# EasyEDA Pro project ProPrj_keero_bot_2026-04-02.epro

# Schematic Schematic

## Sheets
1 Power_Sheet: Board Name: Mainboard; Create Date: 2026-04-02; Page Name: Power_Sheet; Project Name: keero_bot; Schematic Name: Schematic; Update Date: 2026-04-02; Add into BOM: yes; Company: Jakša Tomović; Convert to PCB: yes; Date: 2026-03-09; Draw By: Jakša Tomović; REV: 1.0; Sheet: 1/1; spicePre: .
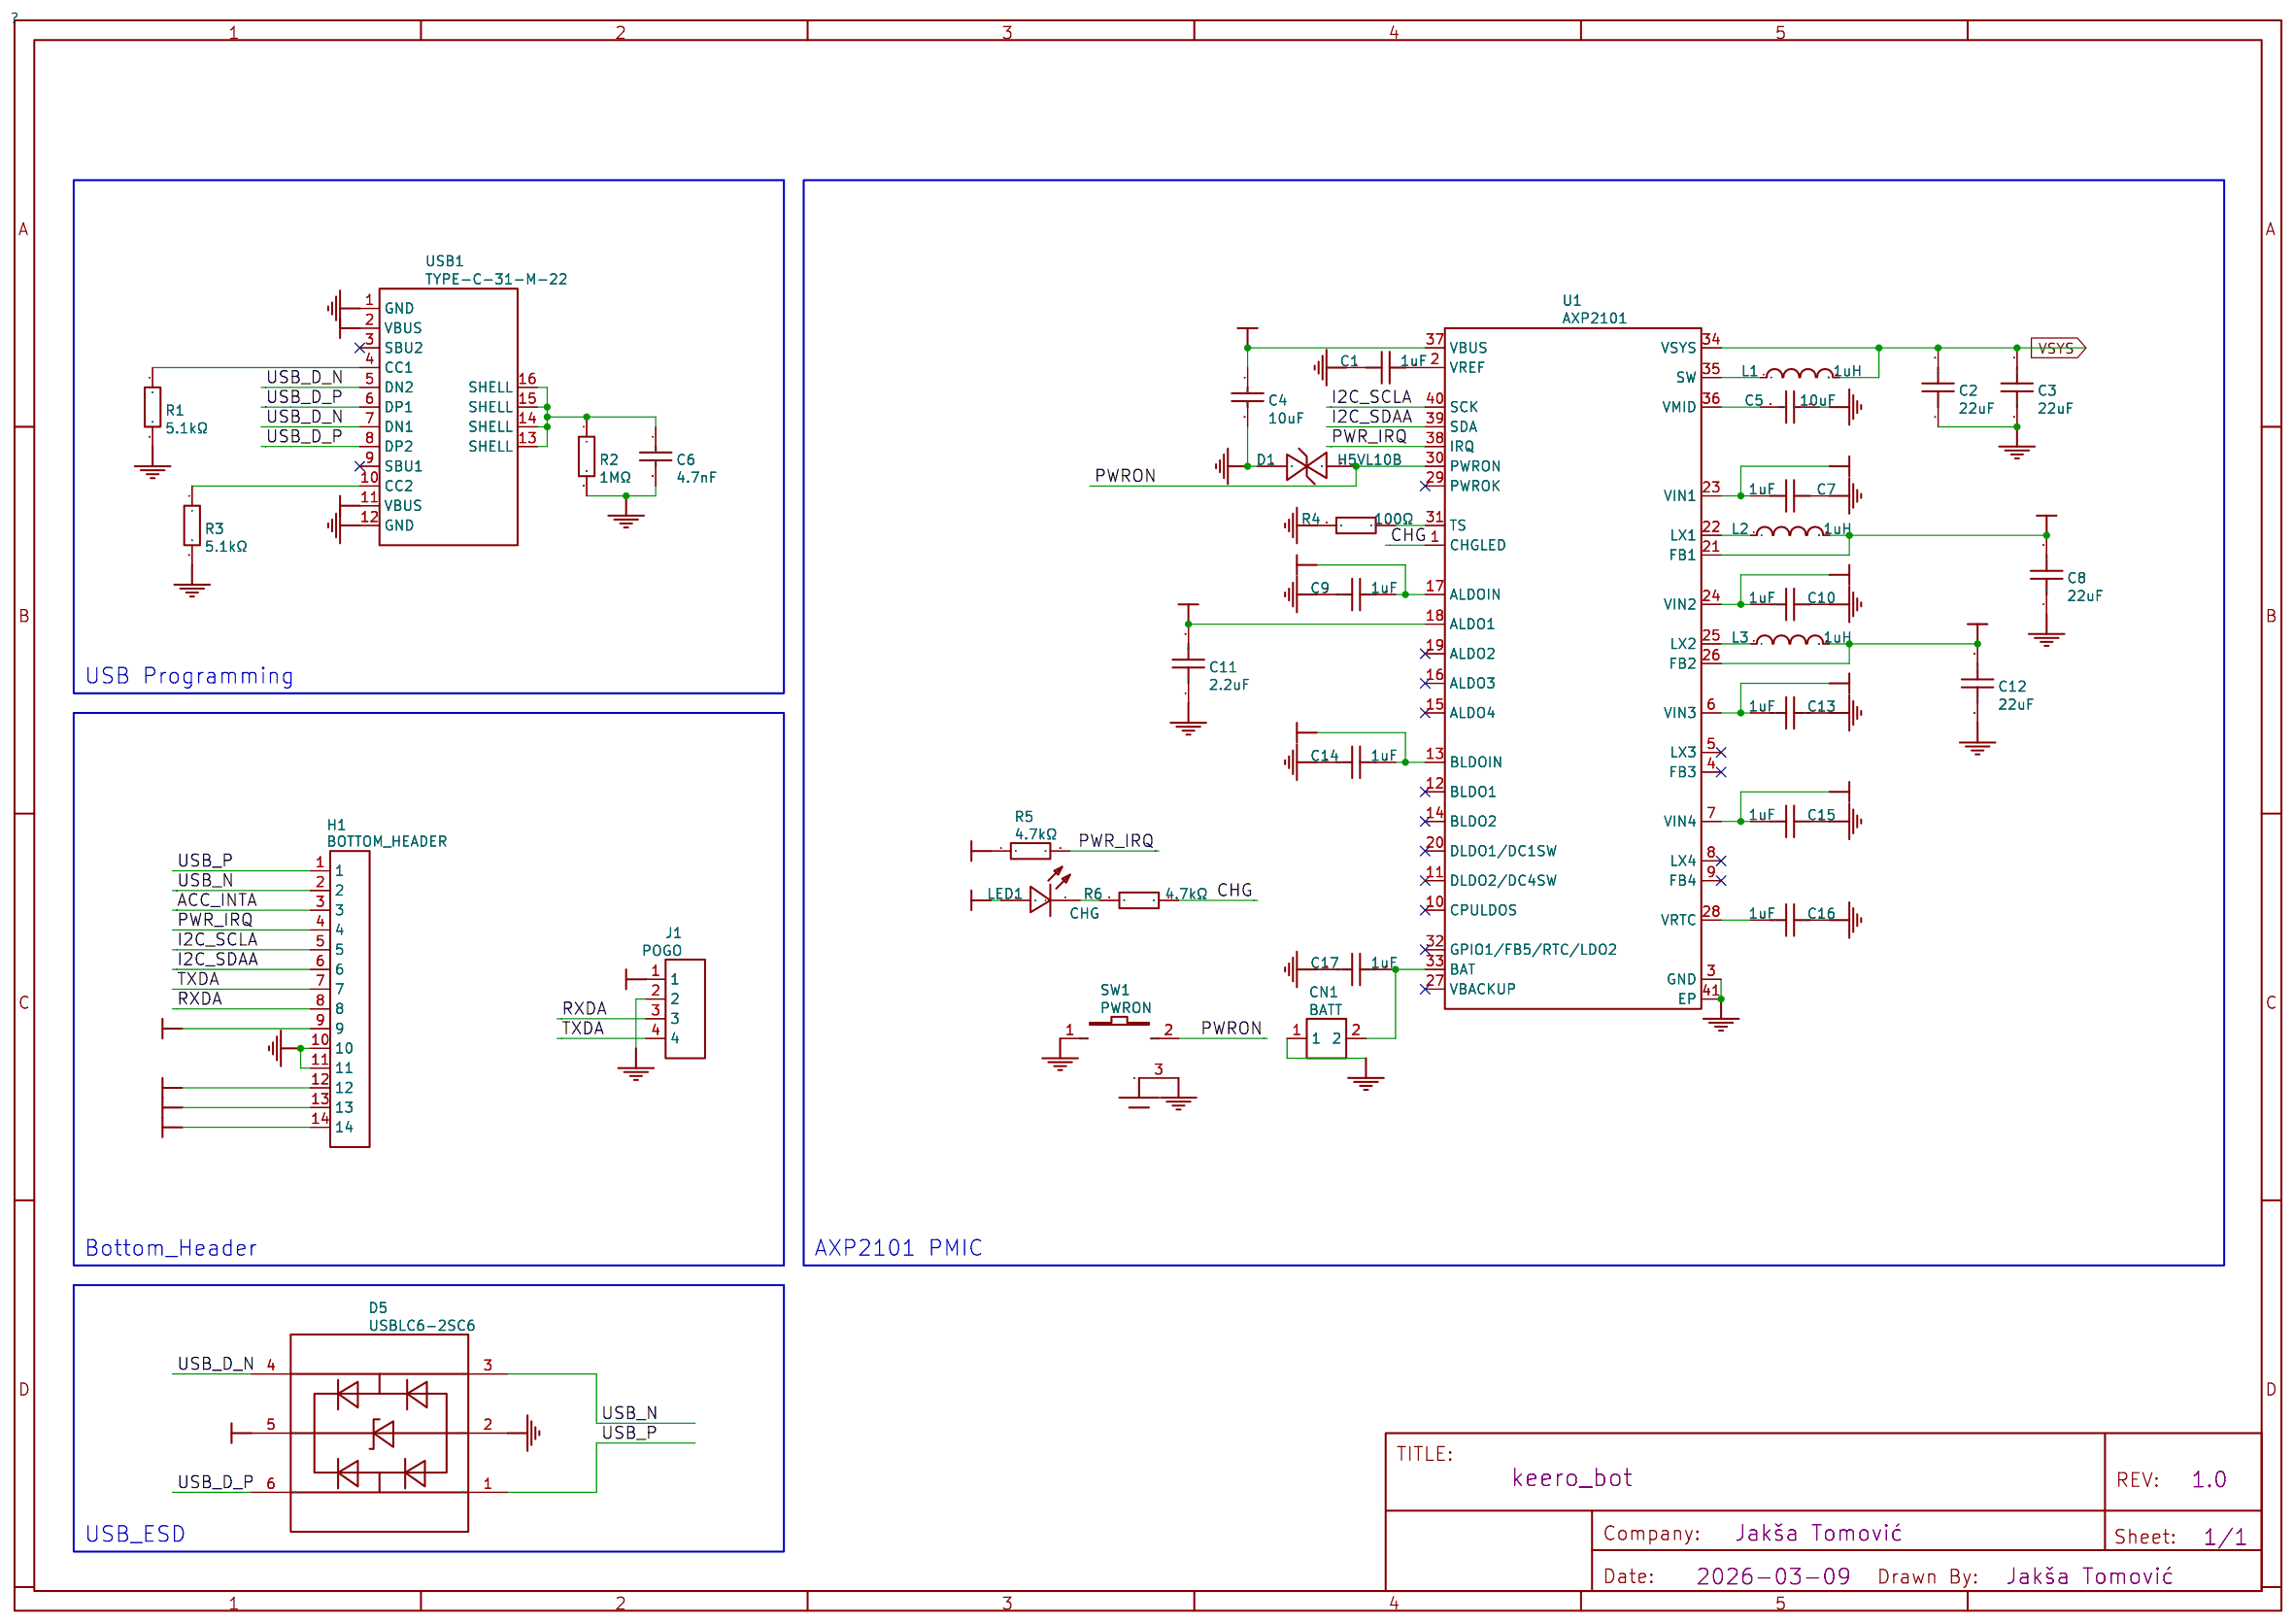
[diagram p0: Power_Sheet]
2 MCU_Sheet: Page Name: MCU_Sheet; Date: 2026-03-04
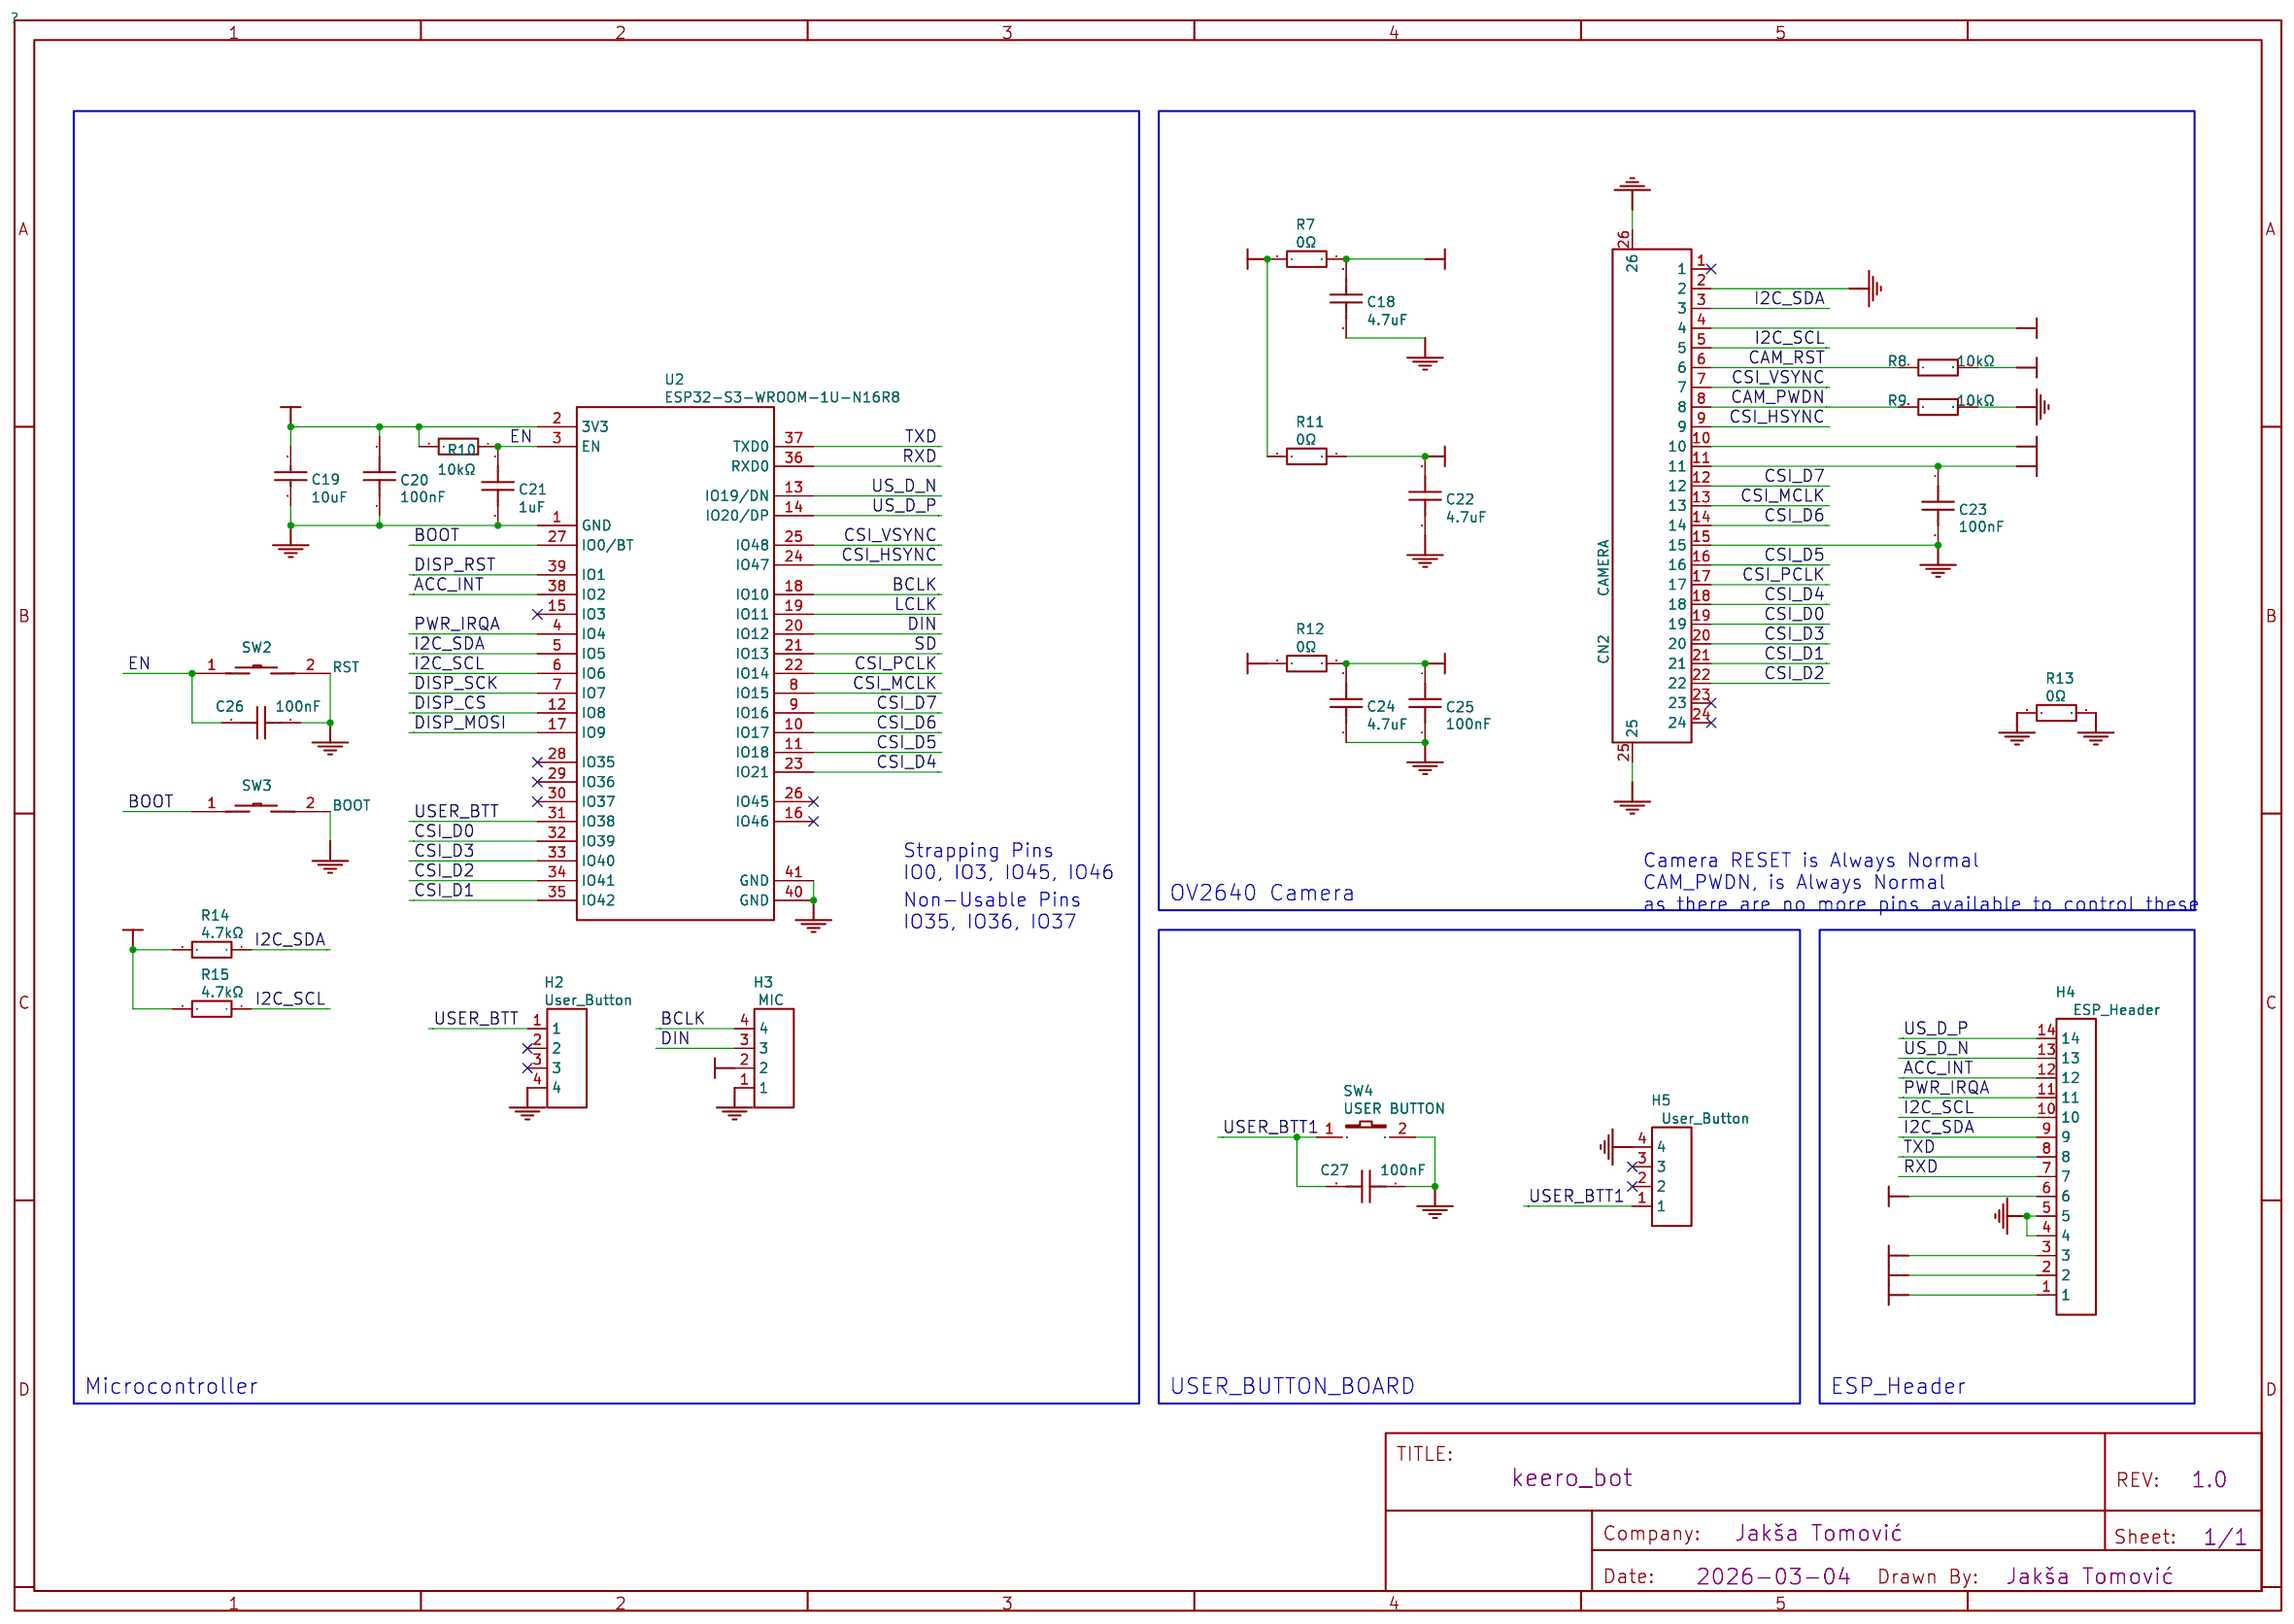
[diagram p1: MCU_Sheet]
3 Sensor_Sheet: Page Name: Sensor_Sheet; Date: 2026-03-08
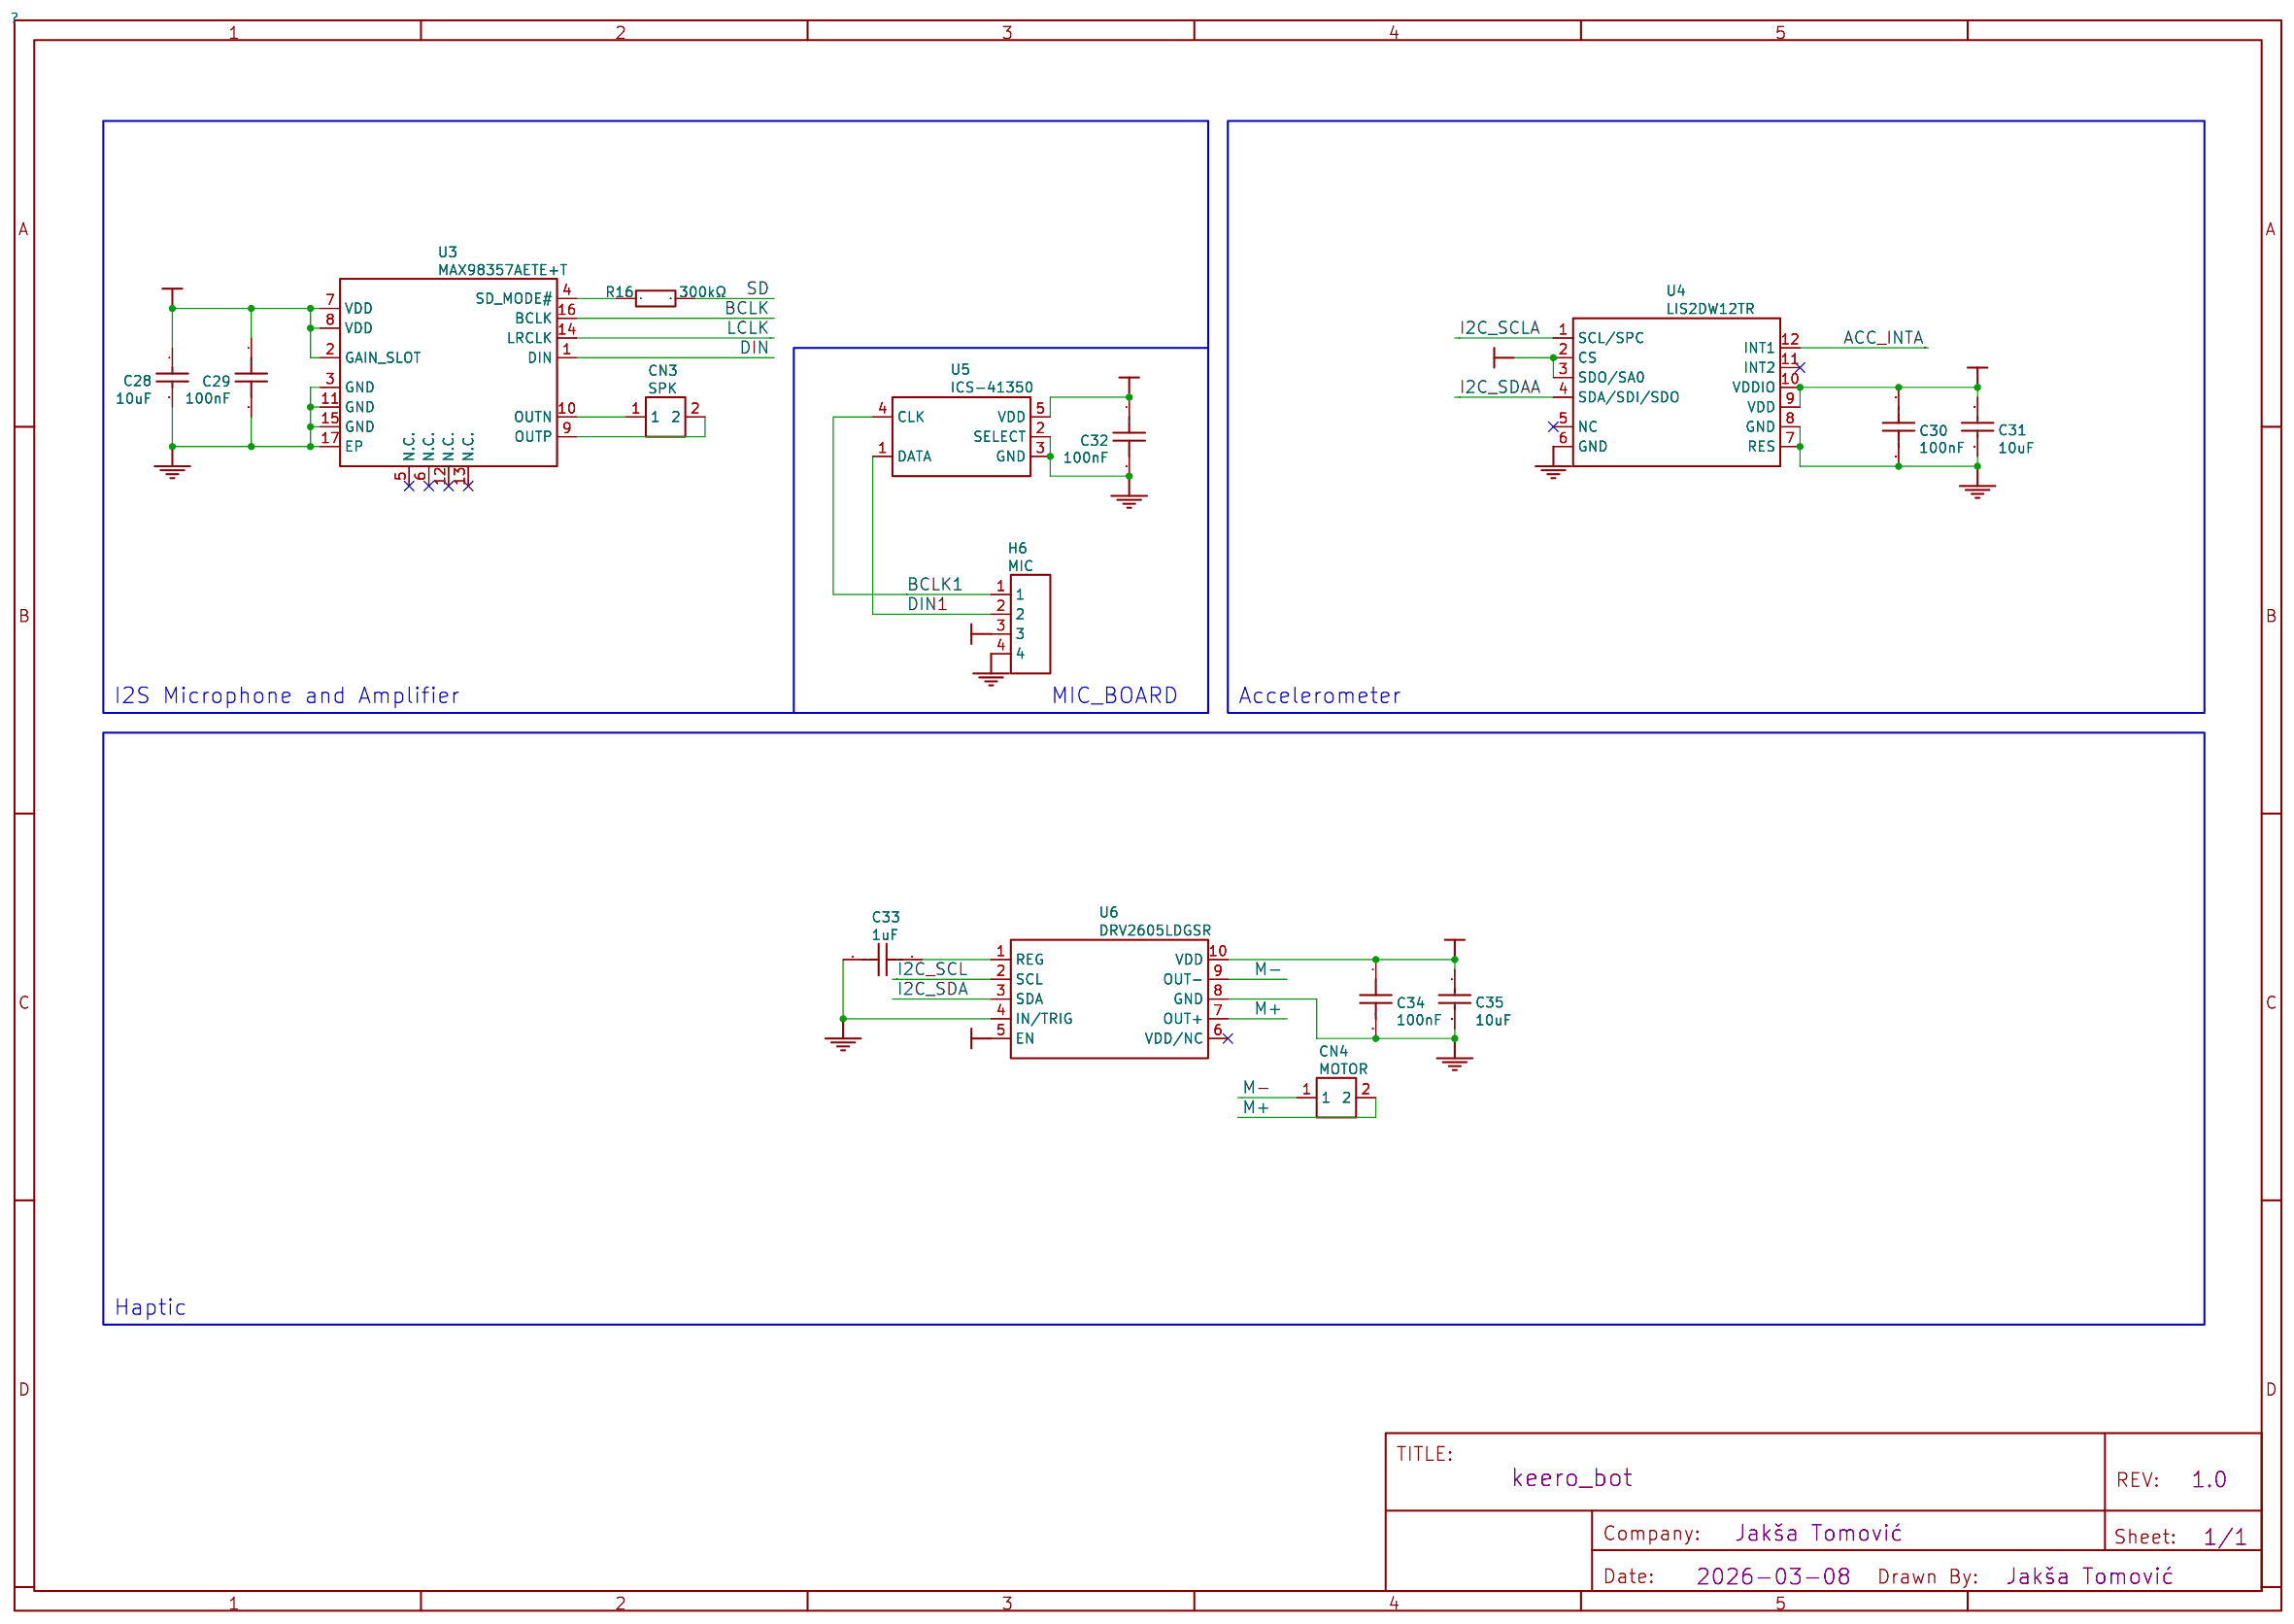
[diagram p2: Sensor_Sheet]
4 OLED_Sheet: Page Name: OLED_Sheet; Date: 2026-03-27
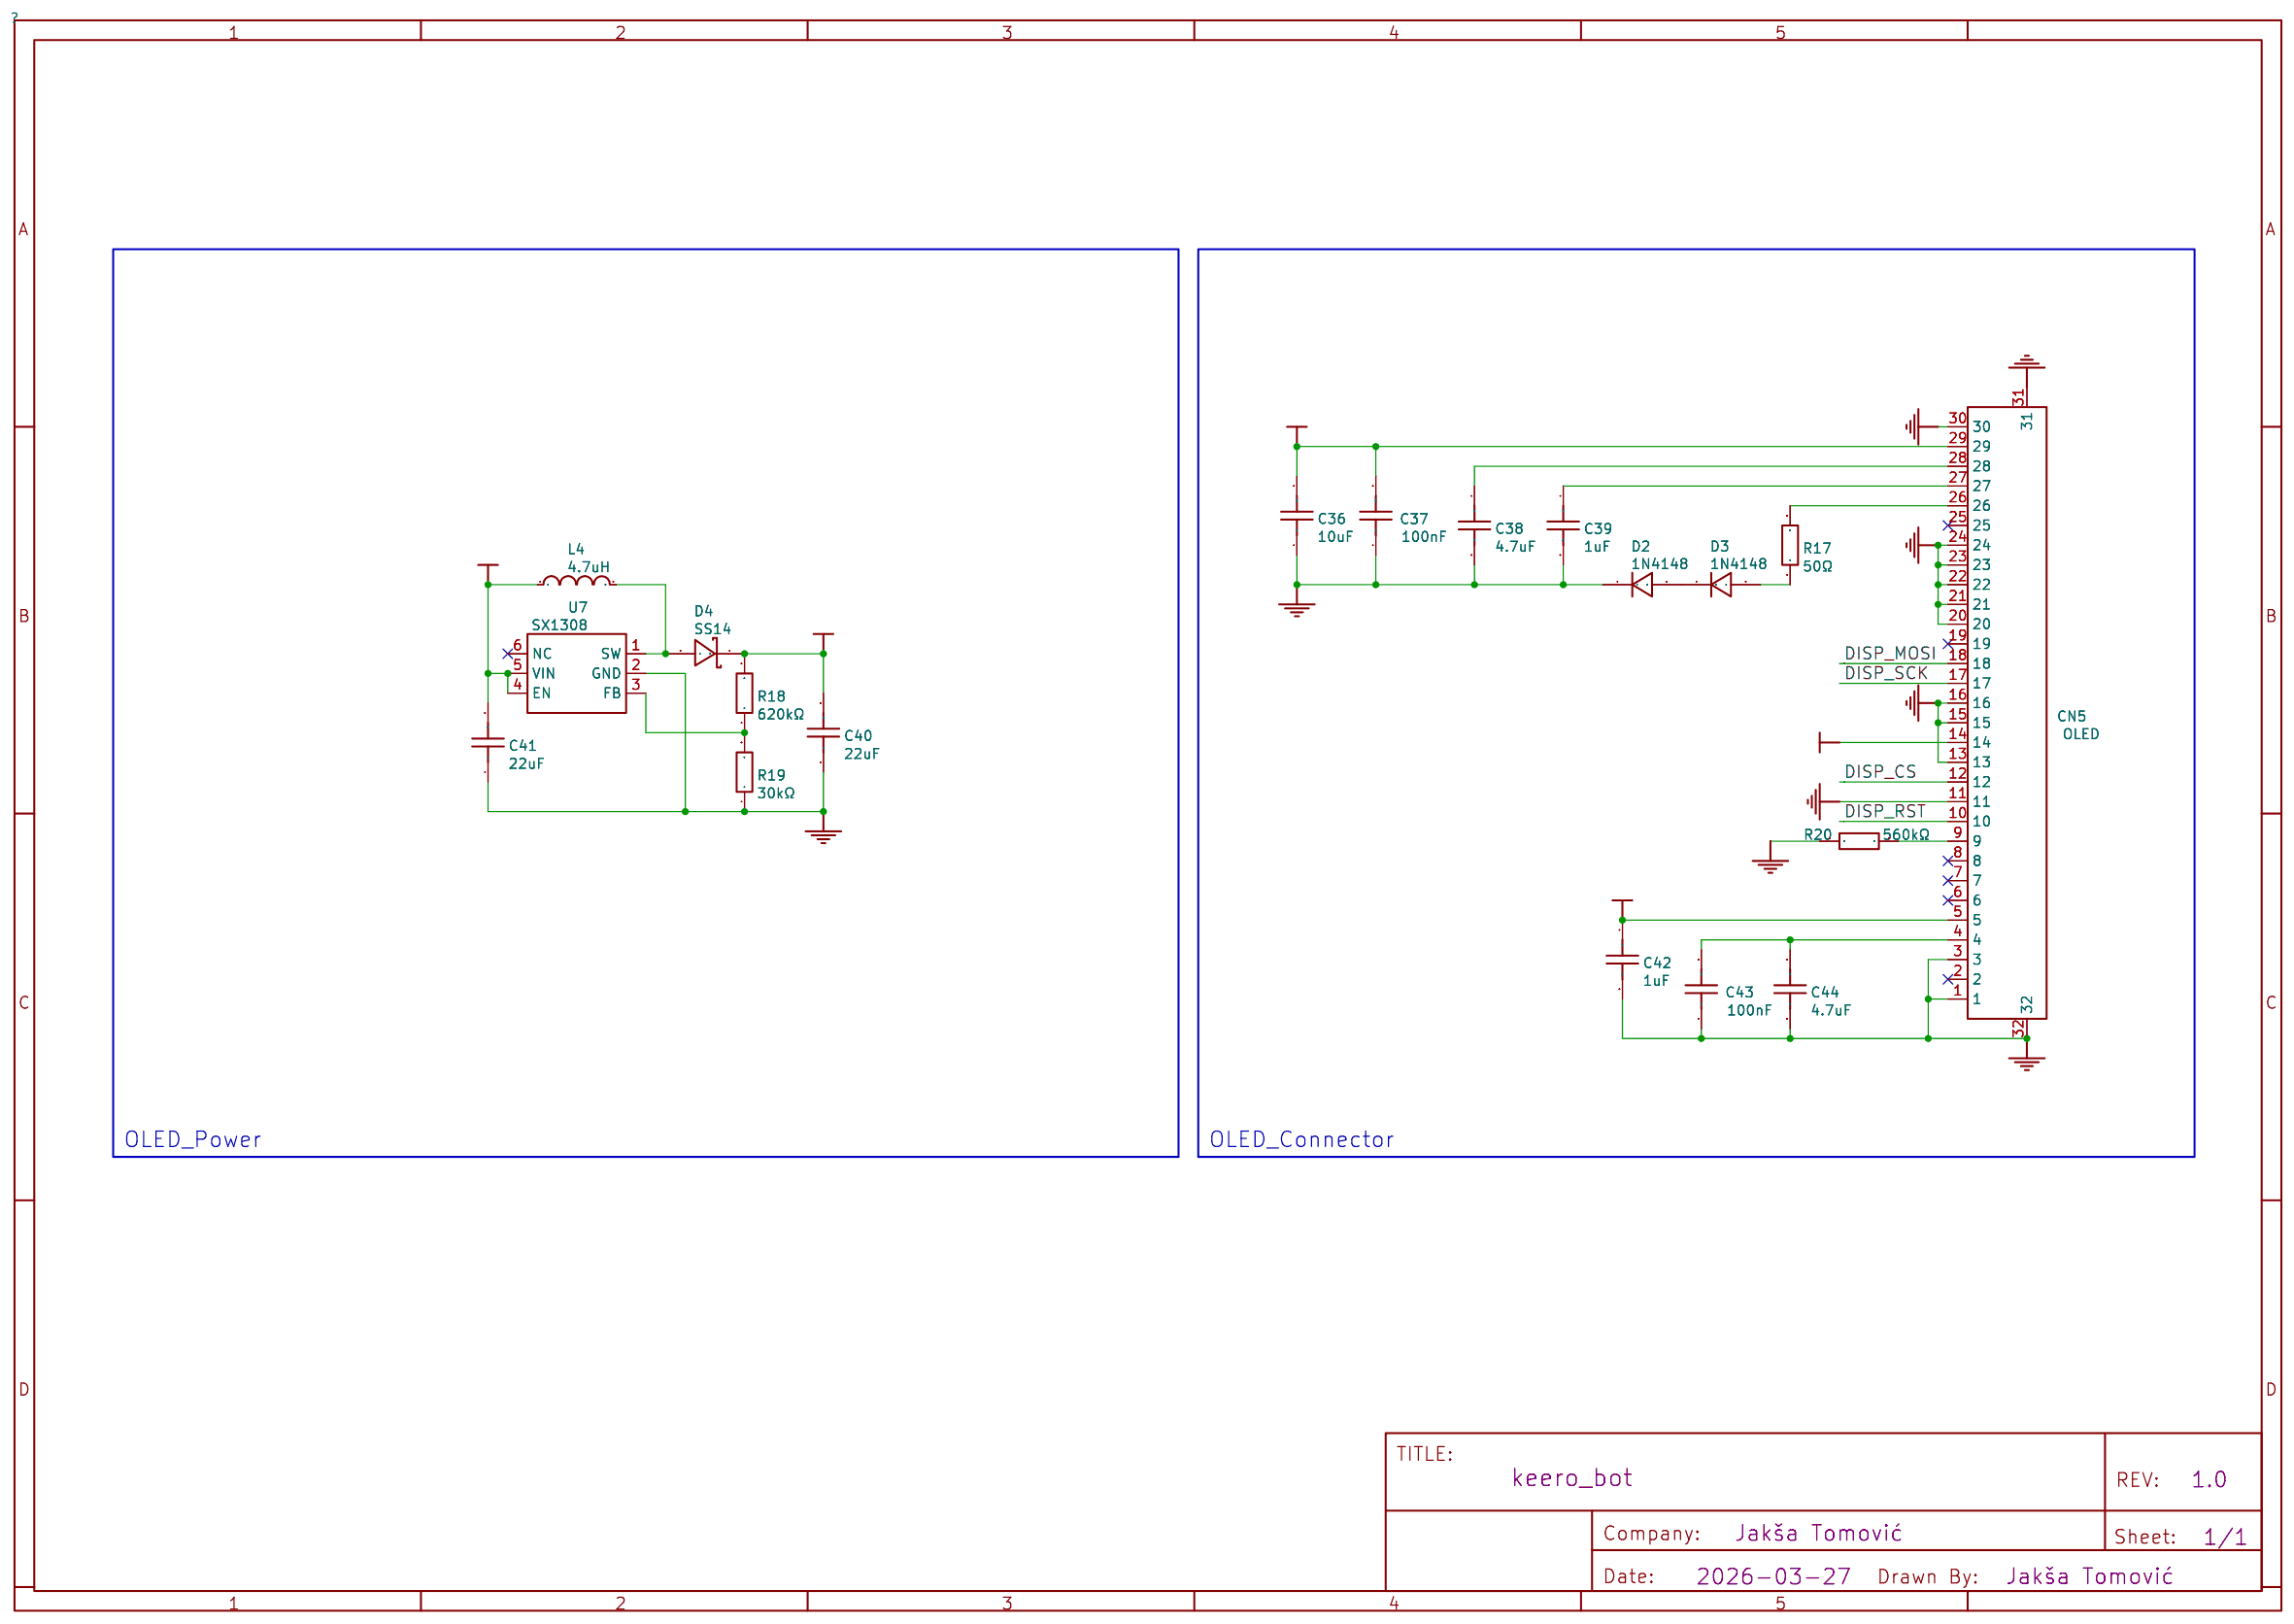
[diagram p3: OLED_Sheet]

## Parts
sheet MCU_Sheet
C18  4.7uF  [C0402_NEW]
C19  10uF  [C0402]
C20  100nF  [C0402]
C21  1uF  [C0402]
C22  4.7uF  [C0402_NEW]
C23  100nF  [C0402]
C24  4.7uF  [C0402_NEW]
C25  100nF  [C0402]
C26  100nF  [C0402]
C27  100nF  [C0402]
CN2  CAMERA  [FPC-SMD_KH-FG0.5-H2.0-24PIN]
H2  User_Button  [HDR-TH_4P-P1.27-V-M]
H3  MIC  [HDR-TH_4P-P1.27-V-M]
H4  ESP_Header  [HDR-TH_14P-P1.27-V-M]
H5  User_Button  [HDR-TH_4P-P1.27-H-F-W4.5-N]
R7  0Ω  [R0402]
R8  10kΩ  [R0402]
R9  10kΩ  [R0402]
R10  10kΩ  [R0402]
R11  0Ω  [R0402]
R12  0Ω  [R0402]
R13  0Ω  [R0402]
R14  4.7kΩ  [R0402]
R15  4.7kΩ  [R0402]
SW2  RST  [KEY-SMD_B3U-1000PM]
SW3  BOOT  [KEY-SMD_B3U-1000PM]
SW4  USER BUTTON  [KEY-SMD_2P-L6.2-W3.6-LS8.0]
U2  ESP32-S3-WROOM-1U-N16R8  [WIRELM-SMD_ESP32-S3-WROOM-1U]
sheet OLED_Sheet
C36  10uF  [C0603]
C37  100nF  [C0402]
C38  4.7uF  [C0402_NEW]
C39  1uF  [C0402]
C40  22uF  [C0805]
C41  22uF  [C0805]
C42  1uF  [C0402]
C43  100nF  [C0402]
C44  4.7uF  [C0402_NEW]
CN5  OLED  [FPC-SMD_KH-FG0.5-H2.0-30PIN]
D2  1N4148  [SOD-323_L1.8-W1.3-LS2.5-RD]
D3  1N4148  [SOD-323_L1.8-W1.3-LS2.5-RD]
D4  SS14  [SMA_L4.2-W2.6-LS5.0-RD_1]
L4  4.7uH  [IND-SMD_L4.4-W4.2]
R17  50Ω  [R0402]
R18  620kΩ  [R0402]
R19  30kΩ  [R0402]
R20  560kΩ  [R0402]
U7  SX1308  [SOT-23-6_L2.9-W1.6-P0.95-LS2.8-BL]
sheet Power_Sheet
C1  1uF  [C0402]
C2  22uF  [C0402_NEW]
C3  22uF  [C0402_NEW]
C4  10uF  [C0402]
C5  10uF  [C0402]
C6  4.7nF  [C0402]
C7  1uF  [C0402]
C8  22uF  [C0402_NEW]
C9  1uF  [C0402]
C10  1uF  [C0402]
C11  2.2uF  [C0402]
C12  22uF  [C0402_NEW]
C13  1uF  [C0402]
C14  1uF  [C0402]
C15  1uF  [C0402]
C16  1uF  [C0402]
C17  1uF  [C0402]
CN1  BATT  [CONN-TH_1.25T-2AW]
D1  H5VL10B  [SOD-882_L1.0-W0.6-BI]
D5  USBLC6-2SC6  [SOT-23-6_L2.9-W1.6-P0.95-LS2.8-BL]
H1  BOTTOM_HEADER  [HDR-TH_14P-P1.27-H-F-W4.5-N]
J1  POGO  [POGO CONTACT 2]
L1  1uH  [L0805]
L2  1uH  [L0805]
L3  1uH  [L0805]
LED1  CHG  [LED0603-RD]
R1  5.1kΩ  [R0402]
R2  1MΩ  [R0402]
R3  5.1kΩ  [R0402]
R4  100Ω  [R0402]
R5  4.7kΩ  [R0402]
R6  4.7kΩ  [R0402]
SW1  PWRON  [KEY-TH_K2-1109DE-CXXW-XX]
U1  AXP2101  [QFN-40_L5.0-W5.0-P0.40-TL-EP3.4]
USB1  TYPE-C-31-M-22  [USB-C-SMD_TYPE-C-31-M-22]
sheet Sensor_Sheet
C28  10uF  [C0402]
C29  100nF  [C0402]
C30  100nF  [C0402]
C31  10uF  [C0402]
C32  100nF  [C0402]
C33  1uF  [C0402]
C34  100nF  [C0402]
C35  10uF  [C0402]
CN3  SPK  [CONN-TH_1.25T-2AW]
CN4  MOTOR  [CONN-TH_1.25T-2AW]
H6  MIC  [HDR-TH_4P-P1.27-H-F-W4.5-N]
R16  300kΩ  [R0402]
U3  MAX98357AETE+T  [TQFN-16_L3.0-W3.0-P0.50-BL-EP1.5]
U4  LIS2DW12TR  [LGA-12_L2.0-W2.0-P0.50-BL]
U5  ICS-41350  [MIC-SMD_5P-L3.5-W2.7-TL]
U6  DRV2605LDGSR  [VSSOP-10_L3.0-W3.0-P0.50-LS4.9-BL]

## Library data of the parts
C18 C22 C24 = 4.7uF: Supplier: LCSC; Manufacturer Part: CL05A475MP5NRNC; Manufacturer: SAMSUNG(三星); Supplier Part: C23733; JLCPCB Part Class: Basic Part; nameAlias: Value; spicePre: C; spiceSymbolName: CL05A475MP5NRNC
C4 C5 C19 C28 C31 C35 = 10uF: Supplier: LCSC; Manufacturer Part: CL05A106MQ5NUNC; Manufacturer: SAMSUNG(三星); Supplier Part: C15525; JLCPCB Part Class: Basic Part; nameAlias: Value; spicePre: C; spiceSymbolName: CL05A106MQ5NUNC
C20 C23 C25-C27 C29 C30 C32 C34 C37 C43 = 100nF: Supplier: LCSC; Supplier Part: C307331; Manufacturer: SAMSUNG(三星); Manufacturer Part: CL05B104KB54PNC; JLCPCB Part Class: Basic Part; nameAlias: Value; Contributor: LCSC; spicePre: C; spiceSymbolName: CL05B104KB54PNC
C1 C7 C9 C10 C13-C17 C21 C33 C39 C42 = 1uF: Supplier: LCSC; Manufacturer: SAMSUNG(三星); Manufacturer Part: CL05A105KA5NQNC; Supplier Part: C52923; JLCPCB Part Class: Basic Part; nameAlias: Value; spicePre: C; spiceSymbolName: CL05A105KA5NQNC
CN2 = CAMERA: JLCPCB Part Class: Extended Part; Supplier: LCSC; Supplier Part: C2797213; Manufacturer: kinghelm(金航标); Manufacturer Part: KH-FG0.5-H2.0-24PIN; Contributor: LCSC; spicePre: C; spiceSymbolName: KH-FG0.5-H2.0-24PIN
H2 = User_Button: Supplier: LCSC; Supplier Part: C2881649; Manufacturer: XKB Connection(中国星坤); Manufacturer Part: X1311WV-04J-C18D27; JLCPCB Part Class: Extended Part; Contributor: LCSC; spicePre: U; spiceSymbolName: X1311WV-04J-C18D27
H3 = MIC: Supplier: LCSC; Supplier Part: C2881649; Manufacturer: XKB Connection(中国星坤); Manufacturer Part: X1311WV-04J-C18D27; JLCPCB Part Class: Extended Part; Contributor: LCSC; spicePre: U; spiceSymbolName: X1311WV-04J-C18D27
H4 = ESP_Header: Supplier: LCSC; Supplier Part: C2881659; Manufacturer: XKB Connection(中国星坤); Manufacturer Part: X1311WV-14J-C18D27; JLCPCB Part Class: Extended Part; Contributor: LCSC; spicePre: U; spiceSymbolName: X1311WV-14J-C18D27
H5 = User_Button: Supplier: LCSC; Supplier Part: C2881475; Manufacturer: XKB Connection(中国星坤); Manufacturer Part: X1311FR-04-C43D24; JLCPCB Part Class: Extended Part; Contributor: LCSC; spicePre: U; spiceSymbolName: X1311FR-04-C43D24
R7 R11-R13 = 0Ω: Supplier: LCSC; Manufacturer: UNI-ROYAL(厚声); Manufacturer Part: 0402WGF0000TCE; Supplier Part: C17168; JLCPCB Part Class: Basic Part; nameAlias: Value; spicePre: R; spiceSymbolName: 0402WGF0000TCE
R8-R10 = 10kΩ: Supplier: LCSC; Manufacturer: UNI-ROYAL(厚声); Manufacturer Part: 0402WGF1002TCE; Supplier Part: C25744; JLCPCB Part Class: Basic Part; nameAlias: Value; spicePre: R; spiceSymbolName: 0402WGF1002TCE
R5 R6 R14 R15 = 4.7kΩ: Supplier: LCSC; Manufacturer: UNI-ROYAL(厚声); Manufacturer Part: 0402WGF4701TCE; Supplier Part: C25900; JLCPCB Part Class: Basic Part; nameAlias: Value; spicePre: R; spiceSymbolName: 0402WGF4701TCE
SW2 = RST: Supplier: LCSC; Supplier Part: C231329; Manufacturer: OMRON(欧姆龙); Manufacturer Part: B3U-1000P; JLCPCB Part Class: Extended Part; Contributor: LCSC; spicePre: S; spiceSymbolName: B3U-1000P
SW3 = BOOT: Supplier: LCSC; Supplier Part: C231329; Manufacturer: OMRON(欧姆龙); Manufacturer Part: B3U-1000P; JLCPCB Part Class: Extended Part; Contributor: LCSC; spicePre: S; spiceSymbolName: B3U-1000P
SW4 = USER BUTTON: Supplier Part: C118141; Supplier: LCSC; Manufacturer Part: K2-1107ST-A4SW-06; 制造商: 韩国韩荣; Contributor: LCEDA_Lib; spicePre: K; spiceSymbolName: K2-3.6×6.1_SMD
U2 = ESP32-S3-WROOM-1U-N16R8: Supplier: LCSC; Supplier Part: C3013946; Manufacturer: ESPRESSIF(乐鑫); JLCPCB Part Class: Extended Part; Contributor: shaikhabdulmobeen; spicePre: U
C36 = 10uF: Supplier: LCSC; Manufacturer: SAMSUNG(三星); Manufacturer Part: CL10A106MA8NRNC; Supplier Part: C96446; JLCPCB Part Class: Basic Part; nameAlias: Value; spicePre: C; spiceSymbolName: CL10A106MA8NRNC
C38 C44 = 4.7uF: Supplier: LCSC; Supplier Part: C318563; Manufacturer: SAMSUNG(三星); Manufacturer Part: CL05A475MO5NUNC; JLCPCB Part Class: Extended Part; nameAlias: Value; Contributor: LCSC; spicePre: C; spiceSymbolName: CL05A475MO5NUNC
C40 C41 = 22uF: Supplier: LCSC; Manufacturer: SAMSUNG(三星); Manufacturer Part: CL21A226MAQNNNE; Supplier Part: C45783; JLCPCB Part Class: Basic Part; nameAlias: Value; spicePre: C; spiceSymbolName: CL21A226MAQNNNE
CN5 = OLED: JLCPCB Part Class: Extended Part; Supplier: LCSC; Supplier Part: C2797216; Manufacturer: kinghelm(金航标); Manufacturer Part: KH-FG0.5-H2.0-30PIN; Contributor: LCSC; spicePre: C; spiceSymbolName: KH-FG0.5-H2.0-30PIN
D2 D3 = 1N4148: Supplier: LCSC; Manufacturer: CJ(江苏长电/长晶); Manufacturer Part: 1N4148WS; Supplier Part: C2128; JLCPCB Part Class: Basic Part; spicePre: D; spiceSymbolName: 1N4148WS T4
D4 = SS14: Supplier: LCSC; Manufacturer: MDD(辰达半导体); Supplier Part: C2480; JLCPCB Part Class: Basic Part; spicePre: D
L4 = 4.7uH: Supplier: LCSC; Manufacturer: cjiang(长江微电); Manufacturer Part: FXL0420-4R7-M; Supplier Part: C167208; JLCPCB Part Class: Extended Part; nameAlias: Value; Contributor: LCSC; spicePre: L; spiceSymbolName: FXL0420-4R7-M
R17 = 50Ω: Supplier: LCSC; Supplier Part: C853312; Manufacturer: YAGEO(国巨); Manufacturer Part: RT0402BRE0750RL; JLCPCB Part Class: Extended Part; Contributor: lcsc; nameAlias: Value; spicePre: U; spiceSymbolName: RT0402BRE0750RL
R18 = 620kΩ: Supplier: LCSC; Manufacturer: UNI-ROYAL(厚声); Manufacturer Part: 0402WGJ0624TCE; Supplier Part: C11860; JLCPCB Part Class: Extended Part; nameAlias: Value; spicePre: R; spiceSymbolName: 0402WGJ0624TCE
R19 = 30kΩ: Supplier: LCSC; Manufacturer: UNI-ROYAL(厚声); Manufacturer Part: 0402WGJ0303TCE; Supplier Part: C25553; JLCPCB Part Class: Extended Part; nameAlias: Value; spicePre: R; spiceSymbolName: 0402WGJ0303TCE
R20 = 560kΩ: Supplier: LCSC; Manufacturer: UNI-ROYAL(厚声); Manufacturer Part: 0402WGJ0564TCE; Supplier Part: C25566; JLCPCB Part Class: Extended Part; nameAlias: Value; spicePre: R; spiceSymbolName: 0402WGJ0564TCE
U7 = SX1308: Supplier: LCSC; Manufacturer: SX(硕芯科技); Supplier Part: C78162; JLCPCB Part Class: Extended Part; sourceId: g4Yg9rJ1j; timeStamp: 1472247539; spicePre: U
C2 C3 C8 C12 = 22uF: Supplier: LCSC; Supplier Part: C105226; Manufacturer: SAMSUNG(三星); Manufacturer Part: CL05A226MQ5QUNC; JLCPCB Part Class: Extended Part; nameAlias: Value; Contributor: lcsc; spicePre: C; spiceSymbolName: CL05A226MQ5QUNC
C6 = 4.7nF: Supplier: LCSC; Manufacturer: FH(风华); Manufacturer Part: 0402B472K500NT; Supplier Part: C1538; JLCPCB Part Class: Basic Part; nameAlias: Value; spicePre: C; spiceSymbolName: 0402B472K500NT
C11 = 2.2uF: Supplier: LCSC; Manufacturer: SAMSUNG(三星); Manufacturer Part: CL05A225MQ5NSNC; Supplier Part: C12530; JLCPCB Part Class: Basic Part; nameAlias: Value; spicePre: C; spiceSymbolName: CL05A105KA5NQNC
CN1 = BATT: Supplier: LCSC; Supplier Part: C722634; Manufacturer: CAX(创都); Manufacturer Part: 1.25T-2AW; JLCPCB Part Class: Extended Part; Contributor: LCSC; spicePre: C; spiceSymbolName: 1.25T-2AW_C722634
D1 = H5VL10B: Supplier: LCSC; Supplier Part: C7420372; Manufacturer: R+O(宏嘉诚); JLCPCB Part Class: Extended Part; Contributor: lcsc; spicePre: D
D5 = USBLC6-2SC6: Supplier: LCSC; Manufacturer: ST(意法半导体); Supplier Part: C7519; JLCPCB Part Class: Extended Part; spicePre: D
H1 = BOTTOM_HEADER: Supplier: LCSC; Supplier Part: C2881485; Manufacturer: XKB Connection(中国星坤); Manufacturer Part: X1311FR-14-C43D24; JLCPCB Part Class: Extended Part; Contributor: LCSC; spicePre: U; spiceSymbolName: X1311FR-14-C43D24
J1 = POGO: Contributor: shaikhabdulmobeen; spicePre: J; spiceSymbolName: POGO CUSTOM
L1-L3 = 1uH: Supplier: LCSC; Manufacturer: Sunlord(顺络); Manufacturer Part: MPL2012S1R0MHT; Supplier Part: C98332; JLCPCB Part Class: Extended Part; nameAlias: Value; spicePre: L; spiceSymbolName: MPL2012S1R0MHT
LED1 = CHG: Supplier: LCSC; Manufacturer: KENTO; Manufacturer Part: KT-0603R; Supplier Part: C2286; JLCPCB Part Class: Basic Part; spicePre: L; spiceSymbolName: KT-0603R
R1 R3 = 5.1kΩ: Supplier: LCSC; Manufacturer: UNI-ROYAL(厚声); Manufacturer Part: 0402WGF5101TCE; Supplier Part: C25905; JLCPCB Part Class: Basic Part; nameAlias: Value; spicePre: R; spiceSymbolName: 0402WGF5101TCE
R2 = 1MΩ: Supplier: LCSC; Manufacturer: UNI-ROYAL(厚声); Manufacturer Part: 0402WGF1004TCE; Supplier Part: C26083; JLCPCB Part Class: Basic Part; nameAlias: Value; spicePre: R; spiceSymbolName: 0402WGF1004TCE
R4 = 100Ω: Supplier: LCSC; Manufacturer: UNI-ROYAL(厚声); Manufacturer Part: 0402WGF1000TCE; Supplier Part: C25076; JLCPCB Part Class: Basic Part; nameAlias: Value; spicePre: R; spiceSymbolName: 0402WGF1000TCE
SW1 = PWRON: Supplier: LCSC; Supplier Part: C223805; Manufacturer: 韩国韩荣; Manufacturer Part: K2-1109DE-A4SW-01; JLCPCB Part Class: Extended Part; Contributor: LCSC; spicePre: S; spiceSymbolName: K2-1109DE-A4SW-01
U1 = AXP2101: Supplier: LCSC; Supplier Part: C3036461; Manufacturer: x-powers; JLCPCB Part Class: Extended Part; Contributor: shaikhabdulmobeen; spicePre: U
USB1 = TYPE-C-31-M-22: Supplier: LCSC; Supplier Part: C530612; Manufacturer: 韩国韩荣; JLCPCB Part Class: Extended Part; Contributor: LCSC; spicePre: U
CN3 = SPK: Supplier: LCSC; Supplier Part: C722634; Manufacturer: CAX(创都); Manufacturer Part: 1.25T-2AW; JLCPCB Part Class: Extended Part; Contributor: LCSC; spicePre: C; spiceSymbolName: 1.25T-2AW_C722634
CN4 = MOTOR: Supplier: LCSC; Supplier Part: C722634; Manufacturer: CAX(创都); Manufacturer Part: 1.25T-2AW; JLCPCB Part Class: Extended Part; Contributor: LCSC; spicePre: C; spiceSymbolName: 1.25T-2AW_C722634
H6 = MIC: Supplier: LCSC; Supplier Part: C2881475; Manufacturer: XKB Connection(中国星坤); Manufacturer Part: X1311FR-04-C43D24; JLCPCB Part Class: Extended Part; Contributor: LCSC; spicePre: U; spiceSymbolName: X1311FR-04-C43D24
R16 = 300kΩ: Supplier: LCSC; Manufacturer: UNI-ROYAL(厚声); Manufacturer Part: 0402WGF3003TCE; Supplier Part: C25774; JLCPCB Part Class: Extended Part; nameAlias: Value; spicePre: R; spiceSymbolName: 0402WGF3003TCE
U3 = MAX98357AETE+T: Supplier: LCSC; Supplier Part: C910544; Manufacturer: ADI(亚德诺)/MAXIM(美信); JLCPCB Part Class: Extended Part; Contributor: shaikhabdulmobeen; spicePre: U
U4 = LIS2DW12TR: Supplier: LCSC; Supplier Part: C189624; Manufacturer: ST(意法半导体); JLCPCB Part Class: Extended Part; Contributor: LCSC; spicePre: U
U5 = ICS-41350: Supplier: LCSC; Supplier Part: C3171856; Manufacturer: TDK InvenSense(应美盛); JLCPCB Part Class: Extended Part; Contributor: shaikhabdulmobeen; spicePre: U
U6 = DRV2605LDGSR: Supplier: LCSC; Supplier Part: C527464; Manufacturer: TI(德州仪器); JLCPCB Part Class: Extended Part; Contributor: LCSC; spicePre: U

## Nets
1V5: H4.3 R12.1
1V5A: C12.2 H1.12 L3.2 U1.26(FB2)
2V8: H4.2 R7.1 R11.1
2V8A: C11.2 H1.13 U1.18(ALDO1)
3V3: C19.1 C20.1 C28.1 C29.1 C34.1 C35.1 C42.1 CN5.5 CN5.14 H3.2 H4.6 R10.2 R14.2 R15.2 U2.2(3V3) U3.2(GAIN_SLOT) U3.7(VDD) U3.8(VDD) U6.5(EN) U6.10(VDD)
3V3A: C8.2 C30.1 C31.1 C41.2 H1.9 J1.1 L2.2 L4.1 R5.1 U1.21(FB1) U4.2(CS) U4.3(SDO/SA0) U4.9(VDD) U4.10(VDDIO) U7.4(EN) U7.5(VIN)
3V3B: C32.1 H6.3 U5.5(VDD)
AGND: C22.1 CN2.2 R13.2
GND: C1.1 C2.1 C3.1 C4.2 C5.2 C6.2 C7.1 C8.1 C9.1 C10.1 C11.1 C12.1 C13.1 C14.1 C15.1 C16.1 C17.1 C18.1 C19.2 C20.2 C21.2 C23.2 C24.1 C25.2 C26.1 C27.1 C28.2 C29.2 C30.2 C31.2 C32.2 C33.2 C34.2 C35.2 C36.1 C37.1 C38.2 C39.2 C40.1 C41.1 C42.2 C43.1 C44.2 CN1.1 CN2.15 CN2.25 CN2.26 CN5.1 CN5.3 CN5.11 CN5.13 CN5.15 CN5.16 CN5.20 CN5.21 CN5.22 CN5.23 CN5.24 CN5.30 CN5.31 CN5.32 D1.2(A) D2.1(K) D5.2 H1.10 H1.11 H2.4 H3.1 H4.4 H4.5 H5.4 H6.4 J1.2 R1.2 R2.2 R3.2 R4.1 R9.2 R13.1 R19.1 R20.1 SW1.1 SW1.3 SW2.2 SW3.2 SW4.2 U1.3(GND) U1.41(EP) U2.1(GND) U2.40(GND) U2.41(GND) U3.3(GND) U3.11(GND) U3.15(GND) U3.17(EP) U4.6(GND) U4.7(RES) U4.8(GND) U5.2(SELECT) U5.3(GND) U6.4(IN/TRIG) U6.8(GND) U7.2(GND) USB1.1(GND) USB1.12(GND)
VBUS: C4.1 D5.5 U1.37(VBUS) USB1.2(VBUS) USB1.11(VBUS)
ACC_INT: H4.12 U2.38(IO2)
ACC_INTA: H1.3 U4.12(INT1)
AV_2.8V: C22.2 CN2.4 R11.2
BCLK: H3.4 U2.18(IO10) U3.16(BCLK)
BCLK1: H6.1 U5.4(CLK)
BOOT: SW3.1 U2.27(IO0/BT)
CAM_PWDN: CN2.8 R9.1
CAM_RST: CN2.6 R8.1
CHG: R6.1 U1.1(CHGLED)
CSI_D0: CN2.19 U2.32(IO39)
CSI_D1: CN2.21 U2.35(IO42)
CSI_D2: CN2.22 U2.34(IO41)
CSI_D3: CN2.20 U2.33(IO40)
CSI_D4: CN2.18 U2.23(IO21)
CSI_D5: CN2.16 U2.11(IO18)
CSI_D6: CN2.14 U2.10(IO17)
CSI_D7: CN2.12 U2.9(IO16)
CSI_HSYNC: CN2.9 U2.24(IO47)
CSI_MCLK: CN2.13 U2.8(IO15)
CSI_PCLK: CN2.17 U2.22(IO14)
CSI_VSYNC: CN2.7 U2.25(IO48)
DIN: H3.3 U2.20(IO12) U3.1(DIN)
DIN1: H6.2 U5.1(DATA)
DISP_CS: CN5.12 U2.12(IO8)
DISP_MOSI: CN5.18 U2.17(IO9)
DISP_RST: CN5.10 U2.39(IO1)
DISP_SCK: CN5.17 U2.7(IO7)
DV_1.5V: C24.2 C25.1 CN2.10 R12.2
DV_2.8V: C18.2 C23.1 CN2.11 R7.2 R8.2
EN: C21.1 C26.2 R10.1 SW2.1 U2.3(EN)
I2C_SCL: CN2.5 H4.10 R15.1 U2.6(IO6) U6.2(SCL)
I2C_SCLA: H1.5 U1.40(SCK) U4.1(SCL/SPC)
I2C_SDA: CN2.3 H4.9 R14.1 U2.5(IO5) U6.3(SDA)
I2C_SDAA: H1.6 U1.39(SDA) U4.4(SDA/SDI/SDO)
LCLK: U2.19(IO11) U3.14(LRCLK)
M+: CN4.2 U6.7(OUT+)
M-: CN4.1 U6.9(OUT-)
PWR_IRQ: H1.4 R5.2 U1.38(IRQ)
PWR_IRQA: H4.11 U2.4(IO4)
PWRON: D1.1(C) SW1.2 U1.30(PWRON)
RXD: H4.7 U2.36(RXD0)
RXDA: H1.8 J1.3
SD: R16.2 U2.21(IO13)
TXD: H4.8 U2.37(TXD0)
TXDA: H1.7 J1.4
US_D_N: H4.13 U2.13(IO19/DN)
US_D_P: H4.14 U2.14(IO20/DP)
USB_D_N: D5.4 USB1.5(DN2) USB1.7(DN1)
USB_D_P: D5.6 USB1.6(DP1) USB1.8(DP2)
USB_N: D5.3 H1.2
USB_P: D5.1 H1.1
USER_BTT: H2.1 U2.31(IO38)
USER_BTT1: C27.2 H5.1 SW4.1
VPP: C36.2 C37.2 CN5.29 H4.1
VPPA: C40.2 D4.1(K) H1.14 R18.2
VSYS: C2.2 C3.2 C7.2 C9.2 C10.2 C13.2 C14.2 C15.2 L1.2 LED1.2(A) U1.6(VIN3) U1.7(VIN4) U1.13(BLDOIN) U1.17(ALDOIN) U1.23(VIN1) U1.24(VIN2) U1.34(VSYS)
$1N5: R4.2 U1.31(TS)
$1N11: C16.2 U1.28(VRTC)
$1N13: C17.2 CN1.2 U1.33(BAT)
$1N14: L1.1 U1.35(SW)
$1N15: C5.1 U1.36(VMID)
$1N20: L2.1 U1.22(LX1)
$1N23: L3.1 U1.25(LX2)
$1N27: LED1.1(K) R6.2
$1N34: C6.1 R2.1 USB1.13(SHELL) USB1.14(SHELL) USB1.15(SHELL) USB1.16(SHELL)
$1N38: R1.1 USB1.4(CC1)
$1N39: R3.1 USB1.10(CC2)
$1N964: C1.2 U1.2(VREF)
$3N10: R16.1 U3.4(SD_MODE#)
$3N11: CN3.2 U3.9(OUTP)
$3N12: CN3.1 U3.10(OUTN)
$3N20: C33.1 U6.1(REG)
$4N2: D4.2(A) L4.2 U7.1(SW)
$4N5: R18.1 R19.2 U7.3(FB)
$4N6: C38.1 CN5.28
$4N7: C39.1 CN5.27
$4N10: CN5.26 R17.2
$4N11: D3.2(A) R17.1
$4N22: CN5.9 R20.2
$4N25: C43.2 C44.1 CN5.4
$4N469: D2.2(A) D3.1(K)

Not connected (* = marked no-connect by the designer): CN2 1* 23* 24*; CN5 2* 6* 7* 8* 19* 25*; H2 2* 3*; H5 2* 3*; U1 4(FB3)* 5(LX3)* 8(LX4)* 9(FB4)* 10(CPULDOS)* 11(DLDO2/DC4SW)* 12(BLDO1)* 14(BLDO2)* 15(ALDO4)* 16(ALDO3)* 19(ALDO2)* 20(DLDO1/DC1SW)* 27(VBACKUP)* 29(PWROK)* 32(GPIO1/FB5/RTC/LDO2)*; U2 15(IO3)* 16(IO46)* 26(IO45)* 28(IO35)* 29(IO36)* 30(IO37)*; U3 5(N.C.)* 6(N.C.)* 12(N.C.)* 13(N.C.)*; U4 5(NC)* 11(INT2)*; U6 6(VDD/NC)*; U7 6(NC)*; USB1 3(SBU2)* 9(SBU1)*

## Notes on the sheets
sheet 1
- USB Programming
- Bottom_Header
- AXP2101 PMIC
- USB_ESD
sheet 2
- Strapping Pins
  IO0, IO3, IO45, IO46
- Camera RESET is Always Normal
  CAM_PWDN, is Always Normal
  as there are no more pins available to control these
- Non-Usable Pins
  IO35, IO36, IO37
- OV2640 Camera
- Microcontroller
- USER_BUTTON_BOARD
- ESP_Header
sheet 3
- I2S Microphone and Amplifier
- MIC_BOARD
- Accelerometer
- Haptic
sheet 4
- OLED_Power
- OLED_Connector

# Board board
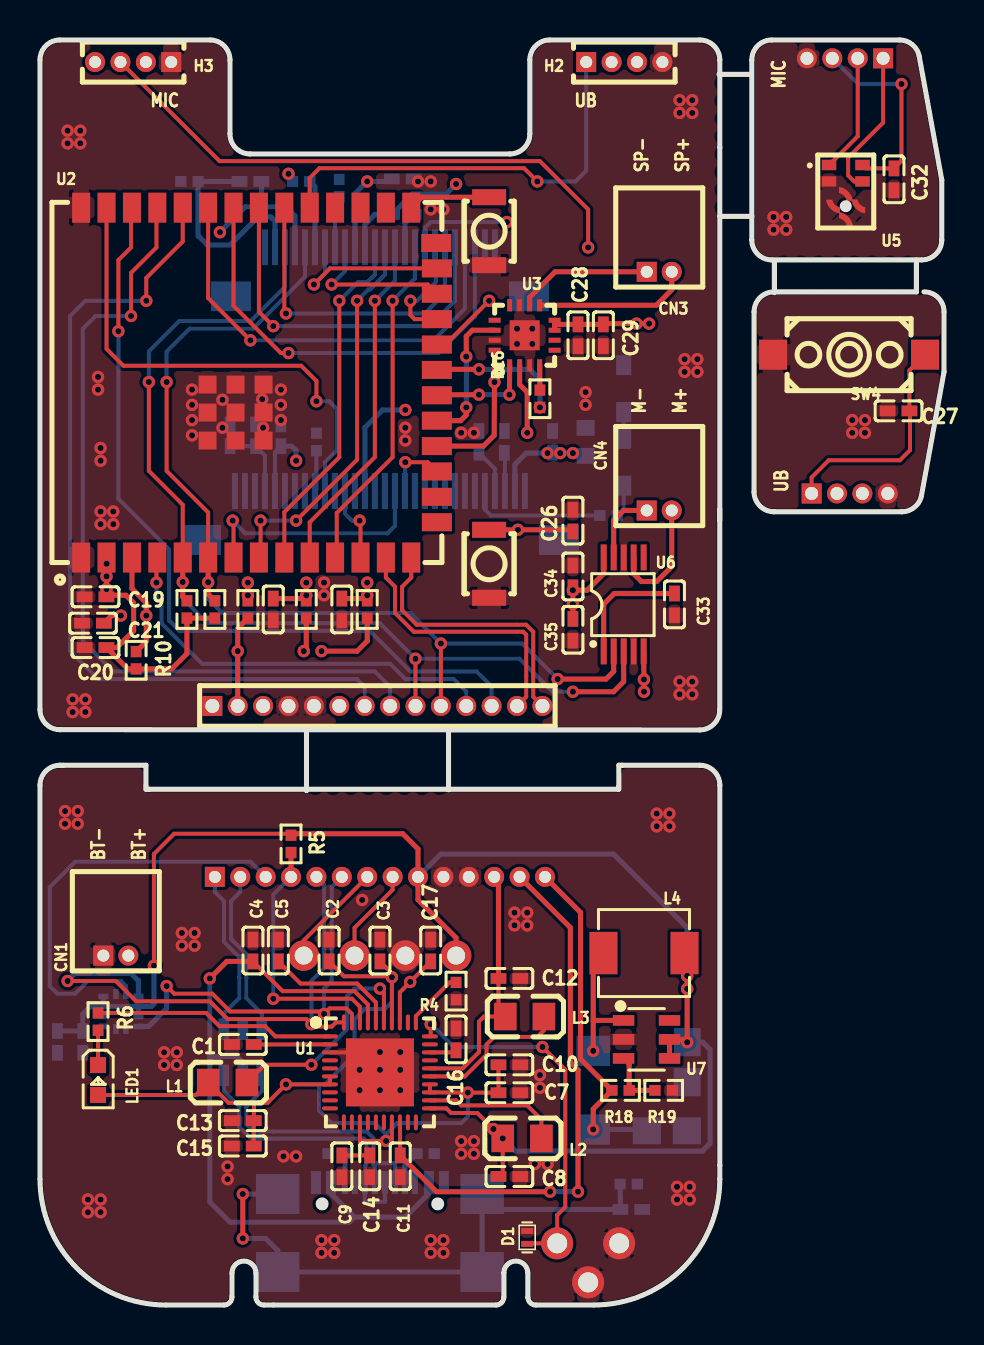
[diagram p4: board, top side]
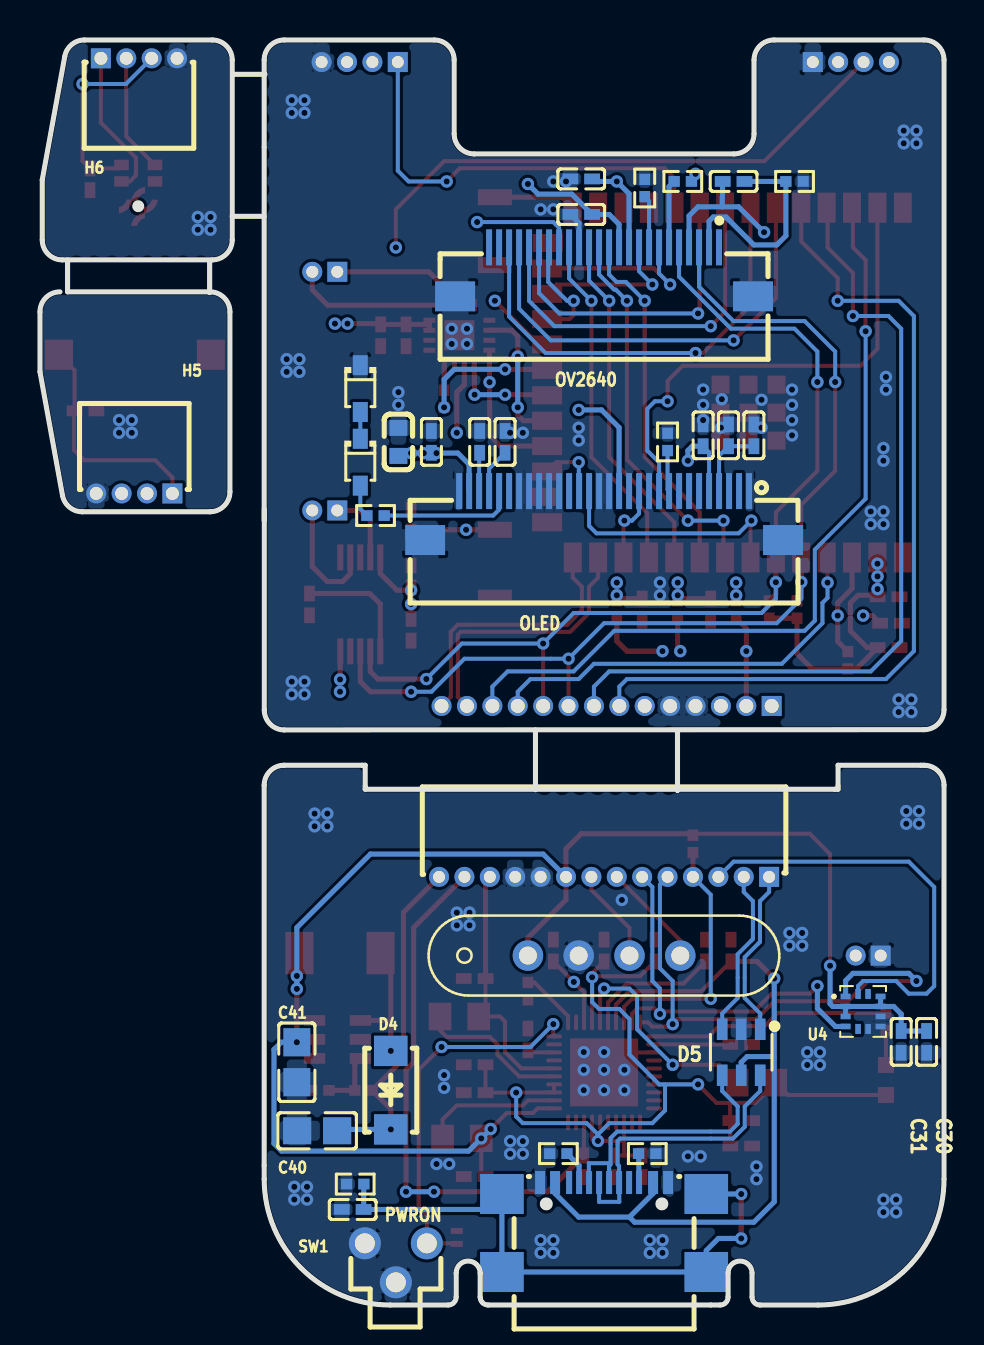
[diagram p5: board, bottom side, seen from below]

Outline 45.21 x 63.28 mm; copper layers: Top Layer, Inner1, Inner2, Bottom Layer. Coordinates in mm from the lower left corner of the outline.
Outline path: 13.33,28.73 13.33,25.73 ; 20.43,28.77 20.43,25.77 ; 33.96,61.56 35.56,61.56 ; 34,39.8 34,29.77 arc(33.7,29.06) 33,28.77 1,28.78 arc(0.29,29.07) 0,29.78 0,62.28 arc(0.29,62.99) 1,63.28 8.5,63.28 arc(9.21,62.99) 9.5,62.28 9.5,58.58 arc(9.79,57.87) 10.5,57.58 23.5,57.58 arc(24.21,57.87) 24.5,58.58 24.5,62.28 arc(24.79,62.99) 25.5,63.28 33,63.28 arc(33.71,62.99) 34,62.28 34,39.24 ; 34,54.46 35.6,54.46 ; 36.73,52.24 36.73,50.64 ; 43.83,52.28 43.83,50.68 36.71,50.68 arc(36.01,50.39) 35.71,49.68 35.71,40.68 arc(36.01,39.97) 36.71,39.68 43.1,39.68 arc(43.74,39.91) 44.09,40.5 45.21,46.68 45.21,49.68 arc(44.92,50.39) 44.21,50.68 ; 0,26 arc(0.29,26.71) 1,27 1.16,27 5.3,27 5.3,25.8 28.95,25.8 28.95,27 33,27 arc(33.71,26.71) 34,26 34,6.99 34,6.3 arc(32.15,1.85) 27.7,0 24.8,0 arc(24.52,0.12) 24.4,0.4 24.4,1.6 arc(23.8,2.2) 23.2,1.6 23.2,0.4 arc(23.08,0.12) 22.8,0 11.67,0 11.2,0 arc(10.92,0.12) 10.8,0.4 10.8,1.6 arc(10.2,2.2) 9.6,1.6 9.6,0.4 arc(9.48,0.12) 9.2,0 6.3,0 arc(1.85,1.85) 0,6.3 0,26 ; 35.6,62.28 35.6,53.28 arc(35.89,52.57) 36.6,52.28 44.1,52.28 arc(44.81,52.57) 45.1,53.28 45.1,56.28 43.97,62.46 arc(43.63,63.05) 42.99,63.28 36.6,63.28 arc(35.89,62.99) 35.6,62.28
Stack: Top Layer 0.035mm / Dielectric1 0.48mm PP er 4.5 / Inner1 0.035mm / Dielectric2 0.48mm FR4 er 4.5 / Inner2 0.035mm / Dielectric3 0.48mm PP er 4.5 / Bottom Layer 0.035mm

## Design rules (mm)
spacing Default (default): track to track 0.152, other pairs 0 to 0.152
track width Default (default): min 0.2, default 0.2, max 25.4
differential pair differentialPair (default): width min 0.127, default 0.254, max 2.54; gap min 0.152, default 0.152
via Default (default): diameter min 0.61, default 0.61, max 100.025; hole min 0.305, default 0.305, max 59.995
pour e324 uses gge129395
pour e407 uses gge134734
pour e420 uses gge129395(1)
pour e848 uses gge129395(2)

## Placement (name value [footprint] x y rotation side)
C1  1uF  [C0402]  10.15 13.03 0 top
C2  22uF  [C0402_NEW]  14.46 17.73 270 top
C3  22uF  [C0402_NEW]  17 17.73 270 top
C4  10uF  [C0402]  10.65 17.73 90 top
C5  10uF  [C0402]  11.92 17.73 90 top
C6  4.7nF  [C0402]  29.57 4.78 0 bottom
C7  1uF  [C0402]  23.47 10.62 180 top
C8  22uF  [C0402_NEW]  23.47 6.43 180 top
C9  1uF  [C0402]  15.1 6.94 90 top
C10  1uF  [C0402]  23.47 12.02 180 top
C11  2.2uF  [C0402]  18.02 6.94 90 top
C12  22uF  [C0402_NEW]  23.47 16.33 180 top
C13  1uF  [C0402]  10.14 9.23 0 top
C14  1uF  [C0402]  16.49 6.94 90 top
C15  1uF  [C0402]  10.14 7.95 0 top
C16  1uF  [C0402]  20.81 13.29 270 top
C17  1uF  [C0402]  19.54 17.73 270 top
C18  4.7uF  [C0402_NEW]  15.1 34.79 90 top
C19  10uF  [C0402]  2.78 35.43 180 top
C20  100nF  [C0402]  2.78 32.89 180 top
C21  1uF  [C0402]  2.65 34.11 180 top
C22  4.7uF  [C0402_NEW]  10.52 56.2 0 bottom
C23  100nF  [C0402]  18.14 54.55 0 bottom
C24  4.7uF  [C0402_NEW]  11.67 34.79 90 top
C25  100nF  [C0402]  18.14 56.33 0 bottom
C26  100nF  [C0402]  26.65 39.24 270 top
C27  100nF  [C0402]  42.94 44.73 0 top
C28  10uF  [C0402]  26.91 48.51 270 top
C29  100nF  [C0402]  28.18 48.51 270 top
C30  100nF  [C0402]  0.87 13.16 270 bottom
C31  10uF  [C0402]  2.14 13.16 270 bottom
C32  100nF  [C0402]  42.71 56.31 270 top
C33  1uF  [C0402]  31.73 35.05 270 top
C34  100nF  [C0402]  26.65 36.44 90 top
C35  10uF  [C0402]  26.65 33.78 270 top
C36  10uF  [C0603]  27.29 43.18 270 bottom
C37  100nF  [C0402]  25.64 43.18 270 bottom
C38  4.7uF  [C0402_NEW]  23.22 43.18 90 bottom
C39  1uF  [C0402]  21.95 43.18 90 bottom
C40  22uF  [C0805]  31.35 8.72 180 bottom
C41  22uF  [C0805]  32.37 12.15 90 bottom
C42  1uF  [C0402]  12.05 43.5 90 bottom
C43  100nF  [C0402]  9.51 43.5 270 bottom
C44  4.7uF  [C0402_NEW]  10.78 43.5 90 bottom
CN1  BATT  [CONN-TH_1.25T-2AW]  3.79 17.48 0 top
CN2  CAMERA  [FPC-SMD_KH-FG0.5-H2.0-24PIN]  17 51.68 180 bottom
CN3  SPK  [CONN-TH_1.25T-2AW]  30.97 51.68 0 top
CN4  MOTOR  [CONN-TH_1.25T-2AW]  30.97 39.75 0 top
CN5  OLED  [FPC-SMD_KH-FG0.5-H2.0-30PIN]  17 39.49 180 bottom
D1  H5VL10B  [SOD-882_L1.0-W0.6-BI]  24.37 3.38 90 top
D2  1N4148  [SOD-323_L1.8-W1.3-LS2.5-RD]  29.19 45.84 270 bottom
D3  1N4148  [SOD-323_L1.8-W1.3-LS2.5-RD]  29.19 42.16 270 bottom
D4  SS14  [SMA_L4.2-W2.6-LS5.0-RD_1]  27.67 10.75 90 bottom
D5  USBLC6-2SC6  [SOT-23-6_L2.9-W1.6-P0.95-LS2.8-BL]  10.14 12.64 0 bottom
H1  BOTTOM_HEADER  [HDR-TH_14P-P1.27-H-F-W4.5-N]  17 21.42 0 bottom
H2  User_Button  [HDR-TH_4P-P1.27-V-M]  29.22 62.18 0 top
H3  MIC  [HDR-TH_4P-P1.27-V-M]  4.66 62.18 180 top
H4  ESP_Header  [HDR-TH_14P-P1.27-V-M]  16.87 29.97 0 top
H5  User_Button  [HDR-TH_4P-P1.27-H-F-W4.5-N]  40.5 40.6 0 bottom
H6  MIC  [HDR-TH_4P-P1.27-H-F-W4.5-N]  40.26 62.36 180 bottom
J1  POGO  [POGO CONTACT 2]  17 17.48 180 bottom
L1  1uH  [L0805]  9.38 11.13 180 top
L2  1uH  [L0805]  24.11 8.33 180 top
L3  1uH  [L0805]  24.24 14.43 180 top
L4  4.7uH  [IND-SMD_L4.4-W4.2]  30.21 17.61 0 top
LED1  CHG  [LED0603-RD]  2.9 11.26 270 top
R1  5.1kΩ  [R0402]  19.29 7.57 0 bottom
R2  1MΩ  [R0402]  29.45 6.05 0 bottom
R3  5.1kΩ  [R0402]  14.84 7.57 180 bottom
R4  100Ω  [R0402]  20.81 15.7 90 top
R5  4.7kΩ  [R0402]  12.56 23.07 270 top
R6  4.7kΩ  [R0402]  2.9 14.18 270 top
R7  0Ω  [R0402]  16.37 34.79 90 top
R8  10kΩ  [R0402]  13.06 56.21 180 bottom
R9  10kΩ  [R0402]  14.97 55.88 90 bottom
R10  10kΩ  [R0402]  4.81 32.25 270 top
R11  0Ω  [R0402]  10.4 34.79 90 top
R12  0Ω  [R0402]  13.32 34.79 90 top
R13  0Ω  [R0402]  7.48 56.2 0 bottom
R14  4.7kΩ  [R0402]  7.35 34.79 270 top
R15  4.7kΩ  [R0402]  8.75 34.79 270 top
R16  300kΩ  [R0402]  25 45.33 270 top
R17  50Ω  [R0402]  28.43 39.49 180 bottom
R18  620kΩ  [R0402]  29.03 10.74 180 top
R19  30kΩ  [R0402]  31.19 10.74 180 top
R20  560kΩ  [R0402]  13.83 43.18 270 bottom
SW1  PWRON  [KEY-TH_K2-1109DE-CXXW-XX]  27.42 2.11 180 bottom
SW2  RST  [KEY-SMD_B3U-1000PM]  22.46 37.08 270 top
SW3  BOOT  [KEY-SMD_B3U-1000PM]  22.46 53.72 270 top
SW4  USER BUTTON  [KEY-SMD_2P-L6.2-W3.6-LS8.0]  40.47 47.54 180 top
U1  AXP2101  [QFN-40_L5.0-W5.0-P0.40-TL-EP3.4]  17 11.64 0 top
U2  ESP32-S3-WROOM-1U-N16R8  [WIRELM-SMD_ESP32-S3-WROOM-1U]  10.95 46.14 90 top
U3  MAX98357AETE+T  [TQFN-16_L3.0-W3.0-P0.50-BL-EP1.5]  24.24 48.51 0 top
U4  LIS2DW12TR  [LGA-12_L2.0-W2.0-P0.50-BL]  4.05 14.69 270 bottom
U5  ICS-41350  [MIC-SMD_5P-L3.5-W2.7-TL]  40.3 55.68 0 top
U6  DRV2605LDGSR  [VSSOP-10_L3.0-W3.0-P0.50-LS4.9-BL]  29.19 35.05 0 top
U7  SX1308  [SOT-23-6_L2.9-W1.6-P0.95-LS2.8-BL]  30.34 13.29 270 top
USB1  TYPE-C-31-M-22  [USB-C-SMD_TYPE-C-31-M-22]  17 3.89 180 bottom

## Footprints (pads in the part's own frame, mm; a bottom-side part is the same pattern mirrored in y, then rotated)
C0402
  rect 0.79x0.54 smd: 1(-0.545,0) 2(0.545,0)
C0402_NEW
  rect 0.79x0.54 smd: 1(-0.545,0) 2(0.545,0)
C0603
  rect 0.8x0.9 smd: 1(-0.7,0) 2(0.7,0)
C0805
  rect 1.41x1.35 smd: 1(-1,0) 2(1,0)
CONN-TH_1.25T-2AW
  rect 1x1 hole 0.6: 1(-0.625,0)
  round 1 hole 0.6: 2(0.625,0)
FPC-SMD_KH-FG0.5-H2.0-24PIN
  rect 0.3x1.8 smd: 1(5.75,1.225) 2(5.25,1.225) 3(4.75,1.225) 4(4.25,1.225) 5(3.75,1.225) 6(3.25,1.225) 7(2.75,1.225) 8(2.25,1.225) 9(1.75,1.225) 10(1.25,1.225) 11(0.75,1.225) 12(0.25,1.225) 13(-0.25,1.225) 14(-0.75,1.225) 15(-1.25,1.225) 16(-1.75,1.225) 17(-2.25,1.225) 18(-2.75,1.225) 19(-3.25,1.225) 20(-3.75,1.225) 21(-4.25,1.225) 22(-4.75,1.225) 23(-5.25,1.225) 24(-5.75,1.225)
  rect 2x1.5 smd: 25(-7.45,-1.225) 26(7.45,-1.225)
FPC-SMD_KH-FG0.5-H2.0-30PIN
  rect 0.3x1.8 smd: 1(7.25,1.225) 2(6.75,1.225) 3(6.25,1.225) 4(5.75,1.225) 5(5.25,1.225) 6(4.75,1.225) 7(4.25,1.225) 8(3.75,1.225) 9(3.25,1.225) 10(2.75,1.225) 11(2.25,1.225) 12(1.75,1.225) 13(1.25,1.225) 14(0.75,1.225) 15(0.25,1.225) 16(-0.25,1.225) 17(-0.75,1.225) 18(-1.25,1.225) 19(-1.75,1.225) 20(-2.25,1.225) 21(-2.75,1.225) 22(-3.25,1.225) 23(-3.75,1.225) 24(-4.25,1.225) 25(-4.75,1.225) 26(-5.25,1.225) 27(-5.75,1.225) 28(-6.25,1.225) 29(-6.75,1.225) 30(-7.25,1.225)
  rect 2x1.5 smd: 31(-8.95,-1.225) 32(8.95,-1.225)
HDR-TH_4P-P1.27-H-F-W4.5-N
  rect 1x1 hole 0.65: 1(-1.905,0)
  round 1 hole 0.65: 2(-0.635,0) 3(0.635,0) 4(1.905,0)
HDR-TH_4P-P1.27-V-M
  rect 1x1 hole 0.6: 1(-1.905,0)
  round 1 hole 0.6: 2(-0.635,0) 3(0.635,0) 4(1.905,0)
HDR-TH_14P-P1.27-H-F-W4.5-N
  rect 1x1 hole 0.6: 1(-8.255,0)
  round 1 hole 0.6: 2(-6.985,0) 3(-5.715,0) 4(-4.445,0) 5(-3.175,0) 6(-1.905,0) 7(-0.635,0) 8(0.635,0) 9(1.905,0) 10(3.175,0) 11(4.445,0) 12(5.715,0) 13(6.985,0) 14(8.255,0)
HDR-TH_14P-P1.27-V-M
  rect 1x1 hole 0.7: 1(-8.255,0)
  round 1 hole 0.7: 2(-6.985,0) 3(-5.715,0) 4(-4.445,0) 5(-3.175,0) 6(-1.905,0) 7(-0.635,0) 8(0.635,0) 9(1.905,0) 10(3.175,0) 11(4.445,0) 12(5.715,0) 13(6.985,0) 14(8.255,0)
IND-SMD_L4.4-W4.2
  rect 1.4x2.12 smd: 1(2.028,0) 2(-2.028,0)
KEY-SMD_2P-L6.2-W3.6-LS8.0
  rect 1.4x1.5 smd: 1(-3.8,0) 2(3.8,0)
KEY-SMD_B3U-1000PM
  rect 0.8x1.7 smd: 1(-1.7,0) 2(1.7,0)
KEY-TH_K2-1109DE-CXXW-XX
  round 1.6 hole 1: 1(-1.55,0.975) 2(1.55,0.975) 3(0,-0.976)
L0805
  rect 1.133x1.377 smd: 1(-0.967,0) 2(0.966,0)
LED0603-RD
  rect 0.8x0.8 smd: 1(-0.749,0) 2(0.749,0)
LGA-12_L2.0-W2.0-P0.50-BL
  rect 0.28x0.5 smd: 1(-0.75,-0.875) 2(-0.25,-0.875) 3(0.25,-0.875) 4(0.75,-0.875) 7(0.75,0.875) 8(0.25,0.875) 9(-0.25,0.875) 10(-0.75,0.875)
  rect 0.5x0.28 smd: 5(0.875,-0.25) 6(0.875,0.25) 11(-0.875,0.25) 12(-0.875,-0.25)
MIC-SMD_5P-L3.5-W2.7-TL
  rect 0.725x0.522 smd: 1(-0.838,1.351) 2(-0.838,0.529) 4(0.838,0.529) 5(0.838,1.351)
  custom 0.38x0.974 smd rot 45: 3(-0.629,-0.728) 3(0.629,-0.718)
  custom 0.974x0.381 smd rot 135: 3(-0.005,-0.093) 3(0.005,-1.352)
POGO CONTACT 2
  round 1.524 hole 0.9: 1(-3.81,0) 2(-1.27,0) 3(1.27,0) 4(3.81,0)
QFN-40_L5.0-W5.0-P0.40-TL-EP3.4
  oval 0.8x0.2 smd: 1(-2.5,1.8) 2(-2.5,1.4) 3(-2.5,1) 4(-2.5,0.6) 5(-2.5,0.2) 6(-2.5,-0.2) 7(-2.5,-0.6) 8(-2.5,-1) 9(-2.5,-1.4) 10(-2.5,-1.8) 21(2.5,-1.8) 22(2.5,-1.4) 23(2.5,-1) 24(2.5,-0.6) 25(2.5,-0.2) 26(2.5,0.2) 27(2.5,0.6) 28(2.5,1) 29(2.5,1.4) 30(2.5,1.8)
  oval 0.2x0.8 smd: 11(-1.8,-2.501) 12(-1.4,-2.501) 13(-1,-2.501) 14(-0.6,-2.501) 15(-0.2,-2.501) 16(0.2,-2.501) 17(0.6,-2.501) 18(1,-2.501) 19(1.4,-2.501) 20(1.8,-2.501) 31(1.8,2.499) 32(1.4,2.499) 33(1,2.499) 34(0.6,2.499) 35(0.2,2.499) 36(-0.2,2.499) 37(-0.6,2.499) 38(-1,2.499) 39(-1.4,2.499) 40(-1.8,2.499)
  rect 3.4x3.4 smd: 41(0,0)
R0402
  rect 0.566x0.54 smd: 1(-0.433,0) 2(0.433,0)
SMA_L4.2-W2.6-LS5.0-RD_1
  rect 1.52x1.68 smd: 1(-1.965,0) 2(1.965,0)
SOD-323_L1.8-W1.3-LS2.5-RD
  rect 1x0.75 smd: 1(-1.173,0) 2(1.173,0)
SOD-882_L1.0-W0.6-BI
  rect 0.3x0.6 smd: 1(-0.325,0) 2(0.325,0)
SOT-23-6_L2.9-W1.6-P0.95-LS2.8-BL
  rect 0.532x1.072 smd: 1(-0.95,-1.149) 2(0,-1.149) 3(0.95,-1.149) 4(0.95,1.149) 5(0,1.149) 6(-0.95,1.149)
TQFN-16_L3.0-W3.0-P0.50-BL-EP1.5
  rect 0.25x0.6 smd: 1(-0.749,-1.5) 2(-0.248,-1.5) 3(0.252,-1.5) 4(0.751,-1.5) 9(0.75,1.5) 10(0.25,1.5) 11(-0.25,1.5) 12(-0.749,1.5)
  rect 0.6x0.25 smd: 5(1.5,-0.748) 6(1.5,-0.248) 7(1.5,0.252) 8(1.5,0.752) 13(-1.5,0.752) 14(-1.5,0.252) 15(-1.5,-0.248) 16(-1.5,-0.748)
  rect 1.5x1.5 smd: 17(0,0)
USB-C-SMD_TYPE-C-31-M-22
  rect 0.5x1.15 smd: 1(-3.2,2.237) 2(-2.45,2.237) 11(2.45,2.237) 12(3.2,2.237)
  rect 0.3x1.15 smd: 3(-1.75,2.237) 4(-1.249,2.237) 5(-0.751,2.237) 6(-0.251,2.237) 7(0.249,2.237) 8(0.75,2.237) 9(1.25,2.237) 10(1.75,2.237)
  rect 2.18x2 smd: 13(5.11,1.663) 14(5.11,-2.237) 15(-5.11,-2.237) 16(-5.11,1.663)
VSSOP-10_L3.0-W3.0-P0.50-LS4.9-BL
  rect 0.3x1.3 smd: 1(-1,-2.35) 2(-0.5,-2.35) 3(0,-2.35) 4(0.5,-2.35) 5(1,-2.35) 6(1,2.35) 7(0.5,2.35) 8(0,2.35) 9(-0.5,2.35) 10(-1,2.35)
WIRELM-SMD_ESP32-S3-WROOM-1U
  rect 1.5x0.9 smd: 1(-8.75,8.895) 2(-8.75,7.625) 3(-8.75,6.355) 4(-8.75,5.085) 5(-8.75,3.815) 6(-8.75,2.545) 7(-8.75,1.275) 8(-8.75,0.005) 9(-8.75,-1.265) 10(-8.75,-2.535) 11(-8.75,-3.805) 12(-8.75,-5.075) 13(-8.75,-6.345) 14(-8.75,-7.615) 27(8.75,-7.615) 28(8.75,-6.345) 29(8.75,-5.075) 30(8.75,-3.805) 31(8.75,-2.535) 32(8.75,-1.265) 33(8.75,0.005) 34(8.75,1.275) 35(8.75,2.545) 36(8.75,3.815) 37(8.75,5.085) 38(8.75,6.355) 39(8.75,7.625) 40(8.75,8.895)
  rect 0.9x1.5 smd: 15(-6.985,-8.895) 16(-5.715,-8.895) 17(-4.445,-8.895) 18(-3.175,-8.895) 19(-1.905,-8.895) 20(-0.635,-8.895) 21(0.635,-8.895) 22(1.905,-8.895) 23(3.175,-8.895) 24(4.445,-8.895) 25(5.715,-8.895) 26(6.985,-8.865)
  rect 0.9x0.9 smd: 41(-2.9,2.575) 41(-2.9,1.175) 41(-2.9,-0.225) 41(-1.5,2.575) 41(-1.5,1.175) 41(-1.5,-0.225) 41(-0.1,2.575) 41(-0.1,1.175) 41(-0.1,-0.225)

## Nets
As in the schematic.

Pads without a net: CN2 1 23 24; CN5 2 6 7 8 19 25; H2 2 3; H5 2 3; U1 4 5 8 9 10 11 12 14 15 16 19 20 27 29 32; U2 15 16 26 28 29 30; U3 5 6 12 13; U4 5 11; U6 6; U7 6; USB1 3 9

## Via types
v1: diameter 0.62, hole 0.31, Top Layer to Bottom Layer, 219 vias

## Routing (per net, layer and track width the routed paths; a pad name or vN(x,y) marks a point on that pad's centre or on a via; arc(x,y) is an arc through that point)
1V5: length 6
  Top Layer w0.254: v1(13.19,32.71) 13.32,32.84 R12.1
  Inner1 w0.254: H4.3 11.16,31.82 12.05,32.71 13.19,32.71
1V5A: length 13
  Top Layer w0.2: 22.93,16.34 22.93,14.77 L3.2 22.21,14.43 21.95,14.18 21.95,12.65 21.14,11.84 U1.26
  Top Layer w0.254: H1.12 22.93,21.2 22.93,16.34
2V8: length 13.2
  Top Layer w0.254: H4.2 v1(9.89,32.71) 9.89,33.85 R11.1 ; R7.1 16.37,33.22 15.86,32.71 v1(14.08,32.71)
  Inner2 w0.254: 9.89,32.71 10.78,33.6 13.19,33.6 14.08,32.71
2V8A: length 28.3
  Top Layer w0.2: C11.2 18,9.14
  Top Layer w0.254: v1(25.51,5.67) 19.83,5.67 18.02,7.48 ; 23.99,21.42 26.53,18.88 26.53,12.15 26.91,11.76 v1(26.91,5.67)
  Bottom Layer w0.254: v1(26.91,5.67) v1(25.51,5.67)
3V3: length 38.9
  Top Layer w0.254: v1(24.37,43.63) 24.37,45.66 23.99,46.04 U3.2 ; 3.32,35.43 v1(3.32,35.81) 3.33,37.39 ; 3.32,35.43 C19.1 ; 3.32,35.43 3.4,35.5 4.3,35.5 4.68,35.12 4.68,33.73 3.84,32.89 C20.1 4.39,31.82 R10.2 6.59,31.82 7.35,32.58 R14.2 R15.2 ; 26.65,35.9 v1(26.65,35.76) ; v1(26.65,35.76) 27.36,35.76 28.19,36.59 U6.10 ; v1(26.65,35.76) v1(26.65,35.07) C35.1 ; 26.91,49.06 25.74,49.05 ; 25.74,49.05 U3.7 ; 25.74,49.05 U3.8 ; C28.1 C29.1 28.21,49.09 v1(29.83,49.09) v1(30.46,49.09) ; 30.19,32.7 v1(30.2,31.29) v1(30.21,30.68)
  Bottom Layer w0.2: C42.1 11.75,42.66 CN5.5
  Bottom Layer w0.254: C42.1 12.59,42.96 12.81,42.74 12.81,42.24 ; v1(18.27,44.77) 17.13,44.77 16.25,43.9 CN5.14
  vias: v1(3.33,37.08) v1(3.33,36.45) v1(12.81,42.23)
3V3A: length 83.1
  Top Layer w0.2: 22.93,6.43 23.14,6.64 v1(23.14,8.33) v1(22.67,8.8) 21.87,9.61 20.56,9.61 20.32,9.84 U1.21 ; v1(5.7,16.97) 5.7,22.56 6.71,23.58 12.48,23.58 R5.1
  Top Layer w0.254: L4.1 32.37,17.48 v1(32.37,16.46) v1(32.37,15.81) v1(32.37,13.15) 32.22,13.29 U7.5 U7.4 ; R5.1 12.63,23.58 18.14,23.58 18.91,22.81 H1.9 18.91,20.27 20.81,18.37 J1.1
  Bottom Layer w0.254: C30.1 C31.1 2.14,14.56 2.52,14.94 U4.9 ; v1(5.7,16.97) 5.7,15.07 5.57,14.94 U4.2 ; U4.9 U4.10 ; U4.9 U4.2 ; v1(32.37,13.15) 33.15,13.15 33.51,12.78 33.51,8.08 33.13,7.7 23.78,7.7 v1(22.67,8.8) ; U4.2 U4.3 ; H1.9 20.05,22.56 28.68,22.56 32.37,18.88 32.37,15.81
3V3B: length 10
  Top Layer w0.2: U5.5 41.31,56.86 C32.1 43.09,57.23 v1(43.09,61.08)
  Bottom Layer w0.2: 39.63,62.36 40.91,61.08 v1(43.09,61.08)
AGND: length 10.8
  Bottom Layer w0.254: C22.1 R13.2 7.91,53.49 8.36,53.03 9.51,53.03 10.9,54.43 11.54,54.43 11.75,54.21 CN2.2
GND: length 4.7
  Top Layer w0.2: U1.3 16,12.64 U1.41
  Bottom Layer w0.254: C23.2 18.25,54.12 CN2.15
  vias: v1(1.25,24.71) v1(1.25,24.07) v1(1.38,58.74) v1(1.38,58.11) v1(1.63,30.3) v1(1.63,29.66) v1(1.89,24.71) v1(1.89,24.07) v1(2.01,58.74) v1(2.01,58.11) v1(2.27,30.3) v1(2.27,29.66) v1(2.4,5.28) v1(2.4,4.64) v1(2.9,46.43) v1(2.9,45.79) v1(3.03,42.87) v1(3.03,42.23) v1(3.03,39.69) v1(3.03,39.06) v1(3.03,5.28) v1(3.03,4.64) v1(3.67,39.69) v1(3.67,39.06) v1(6.21,12.64) v1(6.21,12.01) v1(6.84,12.64) v1(6.84,12.01) v1(7.09,18.61) v1(7.09,17.98) v1(7.6,45.79) v1(7.6,45.03) v1(7.6,44.27) v1(7.6,43.5) v1(7.73,18.61) v1(7.73,17.98) v1(9.13,45.28) v1(9.13,43.89) v1(9.38,6.93) v1(9.38,6.29) v1(11.11,45.31) v1(11.16,43.89) v1(12.05,45.79) v1(12.05,45.03) v1(12.05,44.27) v1(12.17,7.44) v1(12.81,7.44) v1(14.08,3.25) v1(14.08,2.61) v1(14.21,36.14) v1(14.21,35.5) v1(14.71,3.25) v1(14.71,2.61) v1(15.98,11.76) v1(15.98,10.75) v1(16.11,20.26) v1(17,12.65) v1(17,11.76) v1(17,10.75) v1(18.02,12.65) v1(18.02,11.76) v1(18.02,10.75) v1(18.27,43.89) v1(18.27,43.25) v1(18.91,56.2) v1(19.54,56.2) v1(19.54,54.81) v1(19.54,3.25) v1(19.54,2.61) v1(20.18,54.81) v1(20.18,3.25) v1(20.18,2.61) v1(21.06,43.63) v1(21.06,8.2) v1(21.06,7.56) v1(21.7,43.63) v1(21.7,8.2) v1(21.7,7.56) v1(23.73,19.63) v1(23.73,18.99) v1(23.86,48.84) v1(23.86,48.08) v1(24.37,19.63) v1(24.37,18.99) v1(24.62,48.84) v1(24.62,48.08) v1(24.75,7.06) v1(25,11.5) v1(25,10.87) v1(25.38,7.06) v1(27.29,45.66) v1(27.29,45.03) v1(30.84,24.58) v1(30.84,23.95) v1(31.48,24.58) v1(31.48,23.95) v1(31.86,5.91) v1(31.86,5.28) v1(31.99,60.27) v1(31.99,59.63) v1(31.99,31.19) v1(31.99,30.55) v1(32.24,47.31) v1(32.24,46.68) v1(32.49,5.91) v1(32.49,5.28) v1(32.62,60.27) v1(32.62,59.63) v1(32.62,31.19) v1(32.62,30.55) v1(32.88,47.31) v1(32.88,46.68) v1(36.69,54.43) v1(36.69,53.79) v1(37.32,54.43) v1(37.32,53.79) v1(40.62,44.27) v1(40.62,43.63) v1(41.26,44.27) v1(41.26,43.63)
VBUS: length 38.4
  Top Layer w0.2: C4.1 12.14,15.7 15.73,15.7 16.4,15.03 U1.37
  Top Layer w0.254: v1(8.49,16.34) 9.34,17.19 C4.1
  Bottom Layer w0.254: 14.55,6.13 14.55,5.58 15.73,4.4 ; 15.73,4.4 18.27,4.4 19.45,5.58 19.45,6.13 ; 15.73,4.4 15.48,4.14 9.51,4.14 8.49,5.16 v1(8.49,16.34) ; 8.49,12.43 9.85,12.43 10.14,12.14 D5.5
ACC_INT: length 40.5
  Top Layer w0.2: U2.38 4.55,54.85 4.55,52.9 3.92,52.27 v1(3.92,48.71)
  Bottom Layer w0.2: v1(3.92,48.71) 3.92,40.33 6.46,37.79 6.46,34.23 6.97,33.73 16.49,33.73 18.52,31.69 21.83,31.69 22.59,30.93 H4.12
ACC_INTA: length 21.3
  Bottom Layer w0.2: H1.3 10.52,22.18 1.76,22.18 0.49,20.91 0.49,15.96 0.87,15.57 1.76,15.57 2.4,16.21 4.05,16.21 4.3,15.96 4.3,15.56
AV_2.8V: length 27
  Top Layer w0.254: R11.2 v1(10.4,36.14)
  Inner2 w0.254: v1(10.4,35.5) v1(10.4,36.14) 10.4,46.81 9,48.2 v1(9,53.66)
  Bottom Layer w0.254: 11.09,54.94 10.27,54.94 v1(9,53.67) ; 11.09,54.94 C22.2 ; 11.09,54.94 12.3,54.94 12.75,54.48 12.75,52.91
BCLK: length 49.4
  Top Layer w0.254: U3.16 22.73,46.16 22.72,43.51 22.18,42.97 19.85,42.97
  Inner2 w0.2: H3.4 2.75,62.28 3.41,62.94 7.86,62.94 8.87,61.92 8.87,57.98 9.63,57.22 24.87,57.22 26.53,55.57 26.53,47.32 25.38,46.16 22.73,46.16
  vias: v1(22.73,46.16)
BCLK1: length 7.4
  Top Layer w0.2: U5.4 40.72,56.21 40.42,56.51 40.42,57.4 42.17,59.15 42.17,62.36
BOOT: length 4.1
  Top Layer w0.254: SW3.1 19.09,55.42 U2.27
CAM_PWDN: length 2.6
  Bottom Layer w0.2: R9.1 14.75,55.23 CN2.8
CAM_RST: length 3.4
  Bottom Layer w0.254: R8.1 13.75,55.95 CN2.6
CHG: length 12.1
  Top Layer w0.2: R6.1 8.31,14.61 8.97,13.95 11.26,13.95 11.77,13.44 U1.1
CSI_D0: length 16
  Top Layer w0.2: v1(12.3,49.6) 12.22,49.68 U2.32
  Bottom Layer w0.2: CN2.19 20.25,50.62 19.23,49.6 v1(12.3,49.6)
CSI_D1: length 22
  Top Layer w0.2: U2.35 8.41,50.37 v1(10.52,48.26)
  Bottom Layer w0.2: CN2.21 21.25,49.84 19.67,48.26 v1(10.52,48.26)
CSI_D2: length 22.2
  Top Layer w0.2: 9.68,54.89 9.68,49.99 12.05,47.62 v1(12.43,47.62)
  Bottom Layer w0.2: v1(12.43,47.62) 19.92,47.62 21.75,49.45 CN2.22
CSI_D3: length 18.5
  Top Layer w0.2: U2.33 10.95,49.68 v1(11.67,48.97)
  Bottom Layer w0.2: CN2.20 20.75,50.23 19.49,48.97 v1(11.67,48.97)
CSI_D4: length 5.5
  Top Layer w0.2: v1(18.52,50.24) 18.52,49.53 18.73,49.32 U2.23
  Bottom Layer w0.2: CN2.18 19.79,52.87 19.79,51.18 18.85,50.24 v1(18.52,50.24)
CSI_D5: length 17.2
  Top Layer w0.2: v1(17.64,50.24) 17.64,42.41 14.84,39.62 14.84,37.47 U2.11
  Bottom Layer w0.2: CN2.16 18.75,51.35 v1(17.64,50.24)
CSI_D6: length 17.3
  Top Layer w0.2: v1(16.75,50.24) 16.75,42.41 13.49,39.16 U2.10
  Bottom Layer w0.2: CN2.14 17.75,51.24 v1(16.75,50.24)
CSI_D7: length 17.7
  Top Layer w0.2: U2.9 12.22,39.66 14.97,42.41 v1(14.97,50.24)
  Bottom Layer w0.2: v1(14.97,50.24) 15.91,51.18 16.38,51.18 16.75,51.55 CN2.12
CSI_HSYNC: length 7.6
  Top Layer w0.2: v1(14.59,51.05) 19.39,51.05 U2.24
  Bottom Layer w0.2: CN2.9 15.25,51.71 v1(14.59,51.05)
CSI_MCLK: length 19.2
  Top Layer w0.2: v1(12.81,39.24) 15.86,42.29 v1(15.86,50.24) ; U2.8 11.03,37.47 v1(11.03,39.24)
  Bottom Layer w0.2: v1(11.03,39.24) v1(12.81,39.24) ; v1(15.86,50.24) 16.42,50.8 16.5,50.8 17.25,51.55 CN2.13
CSI_PCLK: length 13
  Top Layer w0.2: v1(22.46,50.24) 20.27,48.05 U2.22
  Inner2 w0.2: v1(23.35,54.17) 23.35,51.12 v1(22.46,50.24)
  Bottom Layer w0.2: v1(23.35,54.17) 19.54,54.17 19.25,53.88 CN2.17
CSI_VSYNC: length 8.6
  Top Layer w0.2: U2.25 14.51,51.86 v1(13.7,51.05)
  Bottom Layer w0.2: CN2.7 14.25,51.6 v1(13.7,51.05)
DIN: length 43.9
  Top Layer w0.2: H3.3 8.98,57.22 25,57.22 27.41,54.81 v1(27.41,52.9)
  Top Layer w0.254: U2.20 19.88,45.54 v1(21.95,45.54) ; U3.1 v1(23.48,45.54)
  Inner2 w0.2: v1(23.48,45.54) 25.89,45.54 27.41,47.06 v1(27.41,52.9)
  Bottom Layer w0.254: v1(23.48,45.54) v1(21.95,45.54)
DIN1: length 5.9
  Top Layer w0.2: 40.9,62.36 40.9,58.47 U5.1
DISP_CS: length 3.9
  Top Layer w0.2: U2.12 16.03,39.19 v1(15.98,39.24)
  Bottom Layer w0.2: v1(15.98,39.24) 15.6,39.24 15.25,39.59 CN5.12
DISP_MOSI: length 3.2
  Top Layer w0.2: U2.17 19.39,42.16 v1(18.27,42.16)
  Bottom Layer w0.2: CN5.18 v1(18.27,42.16)
DISP_RST: length 24.8
  Top Layer w0.2: U2.39 3.33,47.83 4.17,46.99 13.06,46.99 13.83,46.22 v1(13.83,45.21)
  Bottom Layer w0.2: 14.25,40.72 14.25,42.15 14.84,42.74 14.84,44.83 14.46,45.21 v1(13.83,45.21)
DISP_SCK: length 12.1
  Top Layer w0.2: v1(9.63,39.24) 9.68,39.19 U2.7
  Bottom Layer w0.2: v1(9.63,39.24) 10.27,38.6 17.38,38.6 17.75,38.97 CN5.17
DV_1.5V: length 31.7
  Top Layer w0.254: C24.2 13.21,35.34 R12.2 v1(13.32,36.14)
  Inner2 w0.254: v1(16.37,56.2) 16.37,55.57 15.35,54.55 14.71,54.55 12.56,52.39 12.56,50.24 14.84,47.95 14.84,37.66 v1(13.32,36.14) v1(13.32,35.5)
  Bottom Layer w0.254: CN2.10 15.75,55.59 v1(16.37,56.2) 17.47,56.2 C25.1
DV_2.8V: length 46.4
  Top Layer w0.254: v1(16.37,36.14) R7.2 16.25,35.34 C18.2
  Inner2 w0.254: 15.35,38.68 15.35,48.33 13.06,50.62 13.06,52.01 15.1,54.05 20.56,54.05 20.81,54.3 20.81,56.08 20.05,56.84 12.68,56.84 12.43,56.59 ; v1(16.37,35.5) 16.37,37.66 15.35,38.68
  Bottom Layer w0.254: R8.2 12.43,56.41 v1(12.43,56.59) ; C23.1 16.75,54.55 16.25,54.06 CN2.11 ; 17.6,54.55 18.61,55.57 20.3,55.57 20.81,56.08
  vias: v1(20.81,56.08)
EN: length 33.9
  Top Layer w0.254: C21.1 3.58,34.49 v1(4.05,34.49) ; R10.1 5.32,33.19 5.32,35.12 4.6,35.84 U2.3 ; C26.2 26.57,38.78 v1(23.9,38.78) SW2.1
  Inner2 w0.2: v1(23.9,38.78) 23.9,35.68 22.72,34.49 v1(4.05,34.49)
  vias: v1(5.32,34.49)
I2C_SCL: length 50.4
  Top Layer w0.2: U2.6 8.41,39.65 6.33,41.73 v1(6.33,46.17) ; 20.05,30.04 v1(20.05,33.09)
  Top Layer w0.254: R15.1 8.41,35.56 v1(8.41,36.16) U2.6 ; U6.2 28.69,31.69 28.31,31.31 v1(25.89,31.31)
  Bottom Layer w0.2: v1(20.05,33.09) 24.11,33.09 v1(25.89,31.31) ; CN2.5 13.25,51.44 10.65,48.84 7.48,48.84 6.33,47.7 v1(6.33,46.17) ; 8.41,36.16 8.41,35.33 9.13,34.62 18.52,34.62 20.05,33.09
I2C_SCLA: length 27.3
  Top Layer w0.2: v1(1.38,16.21) 3.79,16.21 4.81,15.19 8.49,15.19 9.38,14.3 13.32,14.3 v1(13.57,14.05) 13.7,13.92 14.59,13.92 14.8,14.14 U1.40
  Bottom Layer w0.2: v1(13.57,14.05) 13.57,16.21 14.21,16.84 14.21,21.04 H1.5
  Bottom Layer w0.254: U4.1 4.92,16.22 4.55,16.59 1.76,16.59 v1(1.38,16.21)
I2C_SDA: length 52.3
  Top Layer w0.2: v1(5.44,46.17) 5.44,41.73 7.14,40.03 U2.5 ; 18.78,29.92 v1(18.78,32.33)
  Top Layer w0.254: v1(26.65,30.68) 28.68,30.68 29.19,31.19 U6.3 ; R14.1 7.14,35.44 v1(7.14,36.17) U2.5
  Bottom Layer w0.2: v1(5.44,46.17) 5.44,47.7 6.97,49.22 10.53,49.22 12.25,50.94 CN2.3 ; v1(26.65,30.68) 25.64,30.68 23.99,32.33 v1(18.78,32.33) 17,34.11 8.36,34.11 7.14,35.33 v1(7.14,36.17)
I2C_SDAA: length 20.6
  Top Layer w0.2: v1(6.33,15.96) 6.71,15.57 8.62,15.57 9.51,14.69 14.08,14.69 v1(14.21,14.56) 14.49,14.84 15.32,14.84 15.6,14.56 U1.39
  Bottom Layer w0.2: H1.6 14.59,20.91 14.59,16.21 14.21,15.83 v1(14.21,14.56)
  Bottom Layer w0.254: U4.4 5.43,13.94 6.33,14.84 v1(6.33,15.96)
LCLK: length 7.1
  Top Layer w0.254: U3.14 21.62,48.76 21.32,48.46 v1(21.32,47.44) ; v1(21.32,44.9) 21.32,44.52 21.03,44.24 19.85,44.24
  Bottom Layer w0.254: v1(21.32,44.9) v1(21.32,47.44)
M+: length 6
  Top Layer w0.254: U6.7 29.69,36.58 30.08,36.19 30.84,36.19 31.6,36.94 CN4.2
M-: length 3.7
  Top Layer w0.254: U6.9 28.69,39.25 29.19,39.75 CN4.1
PWR_IRQ: length 13
  Top Layer w0.2: U1.38 16,14.92 15.6,15.32 v1(11.67,15.32)
  Top Layer w0.254: R5.2 H1.4
  Bottom Layer w0.2: H1.4 11.67,20.53 v1(11.67,15.32)
PWR_IRQA: length 20.8
  Top Layer w0.2: U2.4 5.82,37.35 v1(5.82,36.14)
  Bottom Layer w0.2: H4.11 21.32,30.68 20.68,31.31 18.27,31.31 17.51,32.08 8.11,32.08 6.08,34.11 6.08,35.12 5.82,35.38 v1(5.82,36.14)
PWRON: length 18.7
  Top Layer w0.2: v1(19.54,14.05) 19.54,13.48 U1.30 ; D1.1 24.4,3.09 SW1.2 25.87,4.5 26.27,4.91 26.27,11.76 v1(25.13,12.91)
  Bottom Layer w0.2: v1(19.54,14.05) 20.68,12.91 v1(25.13,12.91)
RXD: length 42.7
  Top Layer w0.2: v1(5.32,50.24) 5.32,51.38 7.14,53.2 U2.36
  Bottom Layer w0.2: H4.7 16.24,30.93 15.86,31.31 2.9,31.31 1.51,32.71 1.51,49.47 2.27,50.24 v1(5.32,50.24)
RXDA: length 4.7
  Top Layer w0.2: H1.8 17.64,20.77 15.73,18.87 J1.3
SD: length 6.8
  Top Layer w0.254: U2.21 19.88,46.81 v1(21.95,46.81)
  Bottom Layer w0.254: v1(21.95,46.81) 24.49,46.81 25,46.3 v1(25,44.9)
TXD: length 41.5
  Top Layer w0.2: U2.37 5.82,54.85 5.82,52.9 4.55,51.63 v1(4.55,49.47)
  Bottom Layer w0.2: v1(4.55,49.47) 2.78,49.47 2.14,48.84 2.14,33.22 3.67,31.69 16.75,31.69 17.51,30.93 H4.8
TXDA: length 5.3
  Top Layer w0.2: J1.4 13.19,18.24 16.37,21.42
US_D_N: length 13.7
  Top Layer w0.2: U2.13 17.3,36.39 17.76,35.93 17.76,34.61 18.69,33.68 24.16,33.68 24.32,33.53 24.32,30.43 H4.13
US_D_P: length 13.7
  Top Layer w0.2: U2.14 18.57,36.39 18.11,35.93 18.11,34.76 18.84,34.03 24.31,34.03 24.67,33.67 24.67,30.43 H4.14
USB_D_N: length 14.6
  Bottom Layer w0.2: USB1.5 17.76,7.1 16.75,7.1 USB1.7 16.75,6.96 16.68,7.03 16.68,8.35 16.34,8.68 10.7,8.68 10.32,9.06 10.32,9.93 11.09,10.7 D5.4
USB_D_P: length 14.6
  Bottom Layer w0.2: D5.6 9.19,10.7 9.97,9.93 9.97,8.91 10.56,8.33 16.2,8.33 16.32,8.2 16.32,7.03 16.25,6.96 USB1.8 16.24,5.16 17.25,5.16 17.25,6.13
USB_N: length 8.5
  Bottom Layer w0.2: H1.2 10.02,20.66 9.56,20.2 9.56,18.31 10.32,17.55 10.32,15.36 11.09,14.58 D5.3
USB_P: length 8.5
  Bottom Layer w0.2: 8.75,21.42 8.75,20.66 9.2,20.2 9.2,18.16 9.97,17.4 9.97,15.36 9.19,14.58 D5.1
USER_BTT: length 21.4
  Top Layer w0.2: v1(24.87,56.2) 24.21,56.87 13.98,56.87 13.49,56.38 U2.31
  Bottom Layer w0.2: v1(24.87,56.2) 26.78,56.2 27.32,56.74 H2.1
USER_BTT1: length 11.4
  Top Layer w0.2: H5.1 38.59,41.4 39.45,42.26 43,42.26 43.51,42.76 43.51,44.7 C27.2 43.48,46.76 SW4.1
VPP: length 38.7
  Inner1 w0.254: v1(25.38,42.62) v1(26.02,42.62) 26.78,42.62 27.8,41.6 27.8,34.74 26.91,33.85 10.02,33.85 8.62,32.46 H4.1
  Inner2 w0.254: v1(25.38,42.62) v1(26.02,42.62) v1(26.65,42.62)
  Bottom Layer w0.254: C36.2 27.15,42.62 v1(26.65,42.62) v1(26.02,42.62) v1(25.38,42.62) 24.31,42.62 23.75,42.05 CN5.29
VPPA: length 17.1
  Top Layer w0.254: H1.14 27.03,19.64 27.03,12.31 R18.2 27.67,9.81 v1(27.67,8.78)
  Bottom Layer w0.254: v1(27.67,8.78) 30.28,8.78 C40.2
VSYS: length 53.2
  Top Layer w0.2: 10.71,10.11 9.43,10.11 8.42,11.13 ; 10.71,10.11 C13.2 C15.2 ; 10.71,10.11 11.38,10.11 12.3,11.04 ; 16,8.21 17.51,8.21 17.6,8.3 U1.17 ; 16,7.48 15.09,7.48 ; 16,7.48 U1.13 ; 16,7.48 C14.2 ; LED1.2 7.79,10.51 L1.2 ; U1.34 v1(17.6,16.4) 17.6,16.59 C3.2 ; U1.6 U1.7 v1(12.3,11.04) ; C7.2 22.93,12.02 ; 17.6,16.45 15.2,16.45 C2.2 ; U1.24 U1.23 v1(21.4,10.63) 22.93,10.62
  Bottom Layer w0.2: v1(17.6,16.4) 17.6,15.16 17.25,14.81 16.24,14.81 15.73,14.3 15.73,12.53 14.24,11.04 v1(12.3,11.04) ; 17.31,8.54 16.75,9.1 14.59,9.1 13.95,9.73 13.95,10.99 14,11.04 ; 17.31,8.54 17.87,9.1 21.06,9.1 21.4,9.43 v1(21.4,10.63) ; 17.31,8.54 v1(17.31,8.21)
$1N5: length 3
  Top Layer w0.2: 20.81,16.13 20.48,16.13 18.8,14.45 U1.31
$1N11: length 1.4
  Top Layer w0.2: C16.2 20.7,12.64 U1.28
$1N13: length 23.5
  Top Layer w0.2: U1.33 18,15.65 v1(18.51,16.16) C17.2
  Inner2 w0.2: 18.51,16.16 C17.2 19.54,18.32 18.27,19.59 5.32,19.59 4.42,18.69 CN1.2
$1N14: length 11.3
  Top Layer w0.2: L1.1 11.24,12.02 v1(13.57,12.02) ; U1.35 17.2,15.63 v1(17,15.83)
  Bottom Layer w0.2: v1(13.57,12.02) 15.35,13.8 15.35,15.45 15.73,15.83 v1(17,15.83)
$1N15: length 6.7
  Top Layer w0.2: C5.1 13.03,16.08 15.86,16.08 16.8,15.14 U1.36
$1N20: length 6.9
  Top Layer w0.2: L2.1 25.08,9.28 24.37,9.99 21.06,9.99 20.81,10.24 U1.22
$1N23: length 7.6
  Top Layer w0.2: 25.2,14.43 25.2,13.74 24.87,13.42 22.72,13.42 22.33,13.03 22.33,12.53 21.25,11.44 U1.25
$1N27: length 1.7
  Top Layer w0.2: LED1.1 R6.2
$1N34: length 29.7
  Top Layer w0.254: v1(10.14,5.55) v1(10.14,3.33)
  Bottom Layer w0.254: R2.1 C6.1 22.88,4.78 USB1.16 USB1.15 USB1.14 11.89,2.73 11.29,3.33 v1(10.14,3.33) ; USB1.13 v1(10.14,5.55)
$1N38: length 1.7
  Bottom Layer w0.254: R1.1 18.25,6.97 USB1.4
$1N39: length 1.4
  Bottom Layer w0.254: 15.27,7.57 USB1.10
$1N964: length 3.8
  Top Layer w0.2: U1.2 C1.2
$3N10: length 1.2
  Top Layer w0.254: 25,45.77 24.99,47.01
$3N11: length 7.8
  Top Layer w0.254: U3.9 30.82,50.01 31.6,50.79 CN3.2
$3N12: length 6.8
  Top Layer w0.254: U3.10 24.49,50.41 25.76,51.68 CN3.1
$3N20: length 6.1
  Top Layer w0.254: C33.1 28.72,35.59 28.19,35.06 U6.1
$4N2: length 6.6
  Top Layer w0.254: U7.1 27.67,14.24 ; 27.67,14.24 v1(27.67,12.71) ; 27.67,14.24 27.67,17.09 L4.2
$4N5: length 3
  Top Layer w0.254: R19.2 R18.1 29.47,12.06 U7.3
$4N6: length 1.9
  Bottom Layer w0.2: C38.1 23.25,42.6 CN5.28
$4N7: length 2.2
  Bottom Layer w0.2: C39.1 22.75,41.83 CN5.27
$4N10: length 6.8
  Bottom Layer w0.2: CN5.26 22.25,39.79 22.55,39.49 28,39.49
$4N11: length 1.6
  Bottom Layer w0.2: D3.2 29.19,39.82 28.86,39.49
$4N22: length 2.1
  Bottom Layer w0.2: R20.2 13.83,40.79 CN5.9
$4N25: length 3.7
  Bottom Layer w0.2: C43.2 C44.1 11.25,42.49 CN5.4
$4N469: length 1.3
  Bottom Layer w0.2: D3.1 D2.2

## Copper pours and planes (outline as drawn; the poured copper is in the pictures)
3V3 on Inner2: -2.18,65.73 33,65.73 34.53,64.21 34.53,30.93 36.3,29.15 35.8,29.15 34.91,28.26 -0.78,28.26 -1.41,28.9
GND on Top Layer: -3.45,65.22 46.34,65.22 46.34,64.84 49.89,64.84 49.89,-1.71 -2.94,-1.71 -2.94,-0.95
GND on Top Layer: 7.09,46.68 12.43,46.68 12.43,42.62 7.09,42.62
GND on Bottom Layer: -2.18,64.08 47.61,64.08 47.61,63.7 51.16,63.7 51.16,-2.85 -1.67,-2.85 -1.67,-2.09
GND on Inner1: -4.34,66.36 45.45,66.36 45.45,65.98 49,65.98 49,-0.56 -3.83,-0.56 -3.83,0.2

## Text on the board
Bottom Silkscreen Layer: OV2640 | OLED | PWRON
Top Silkscreen Layer: MIC | UB | BT- | BT+ | M- | SP- | M+ | SP+
